# EAGLE board M840K (EAGLE 6.6.0), part 1 of 2
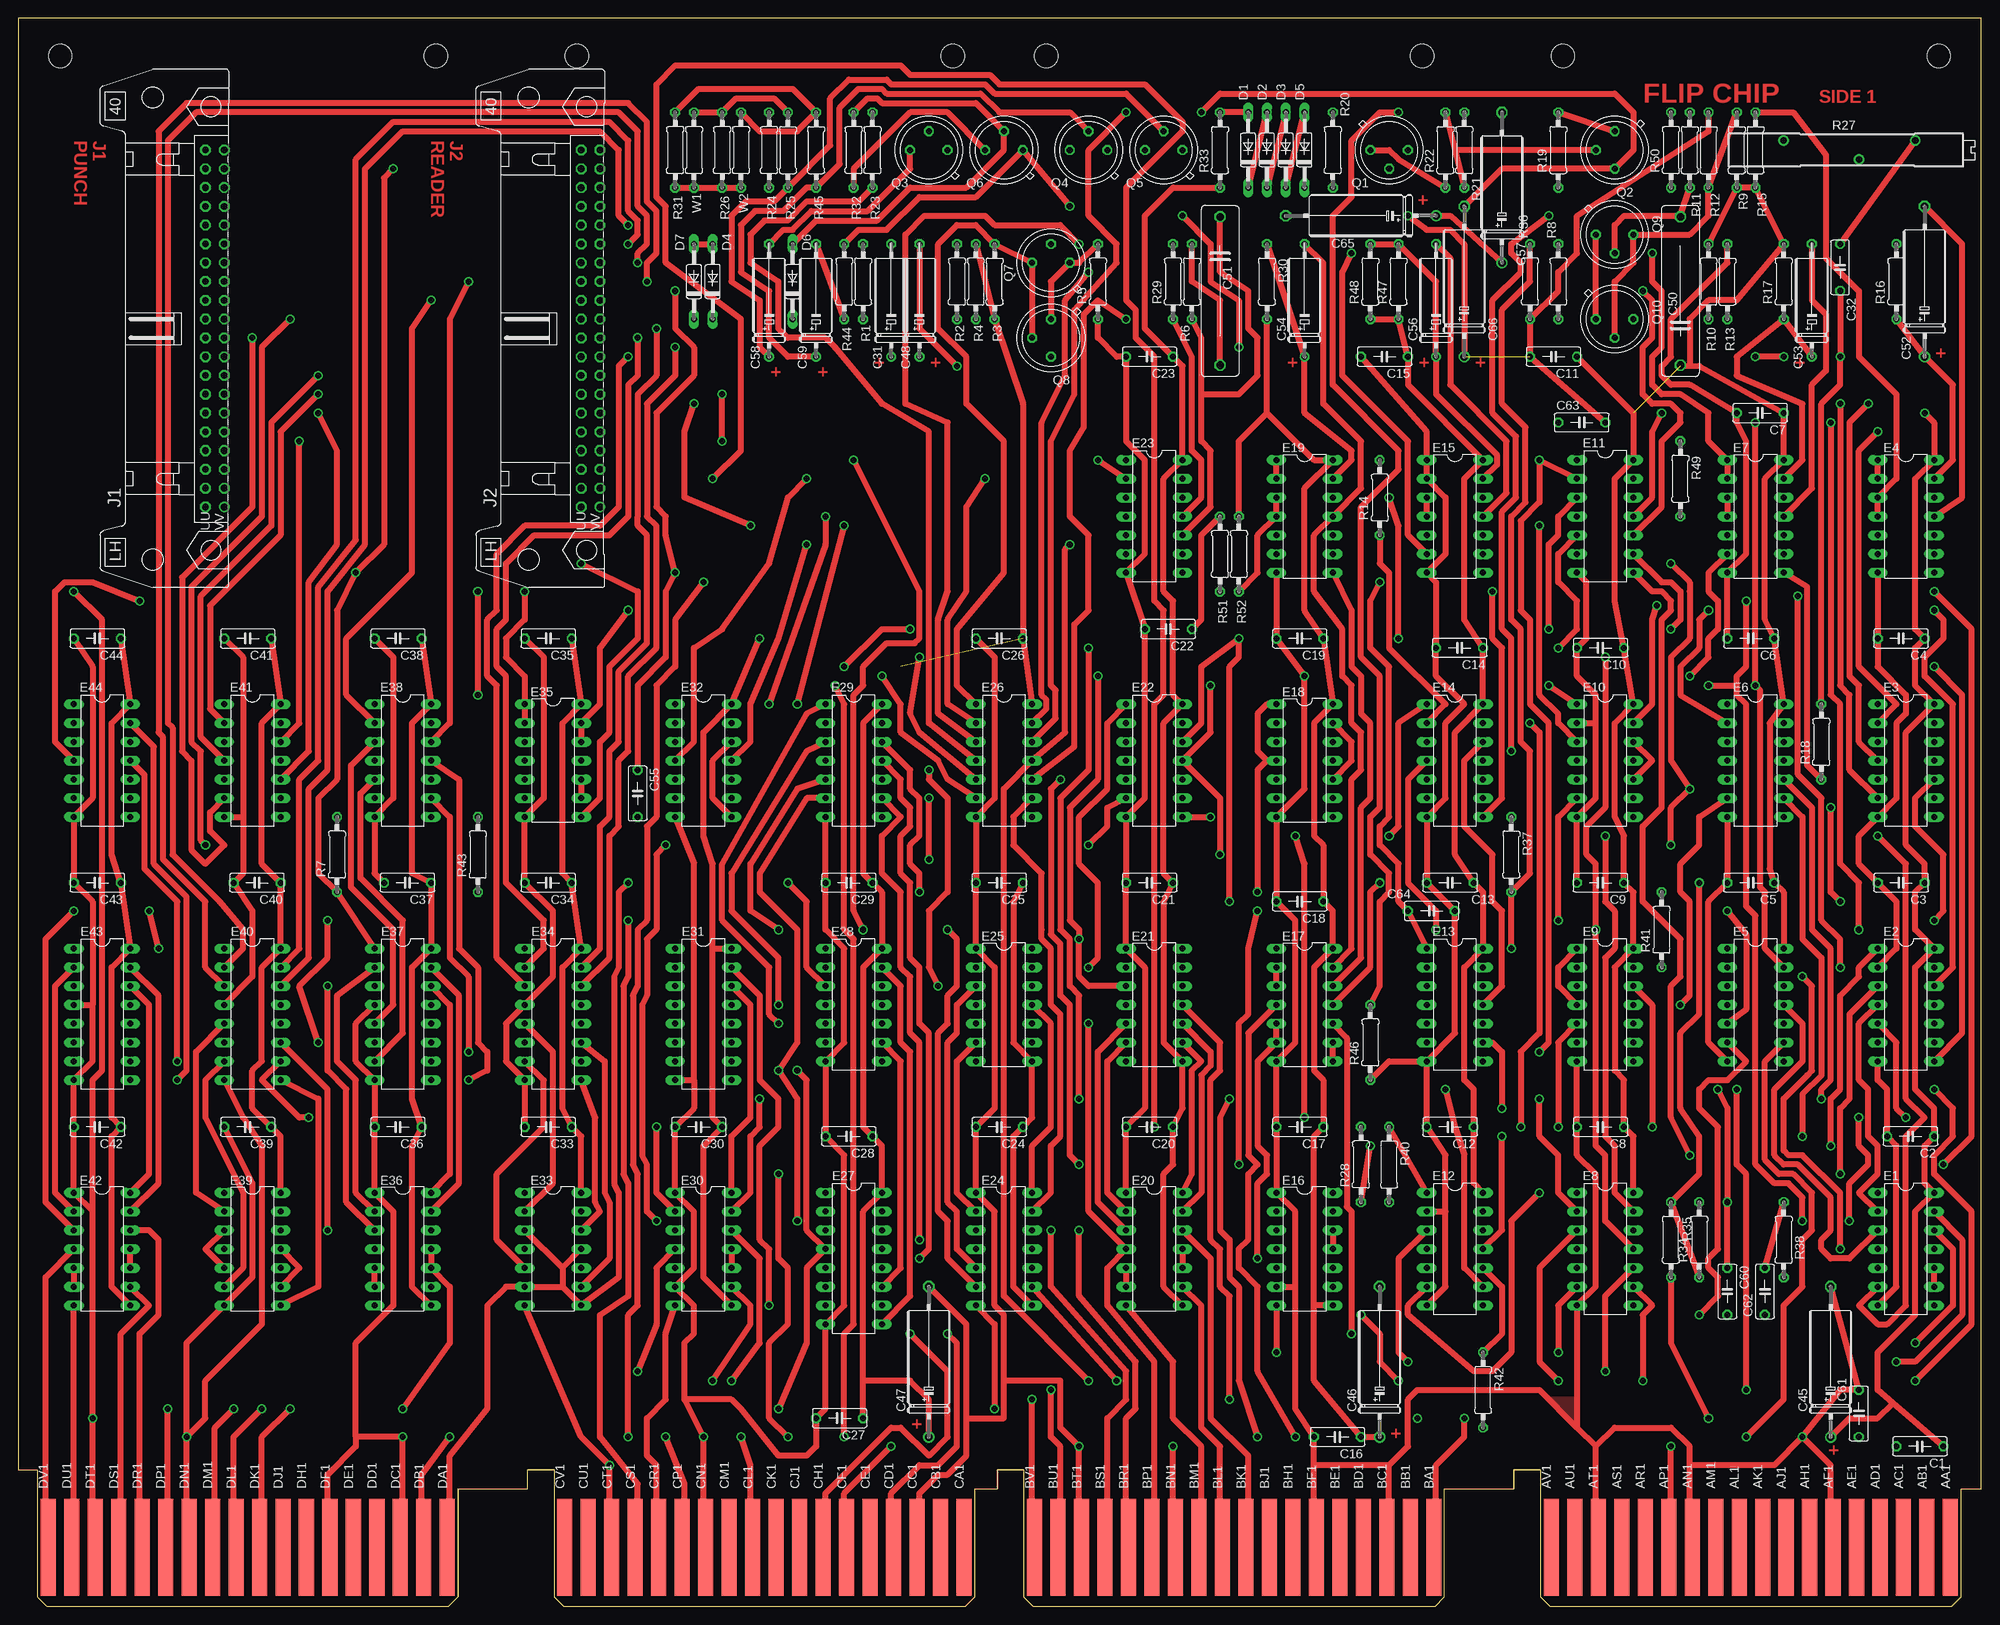
[diagram p4: board, top side]
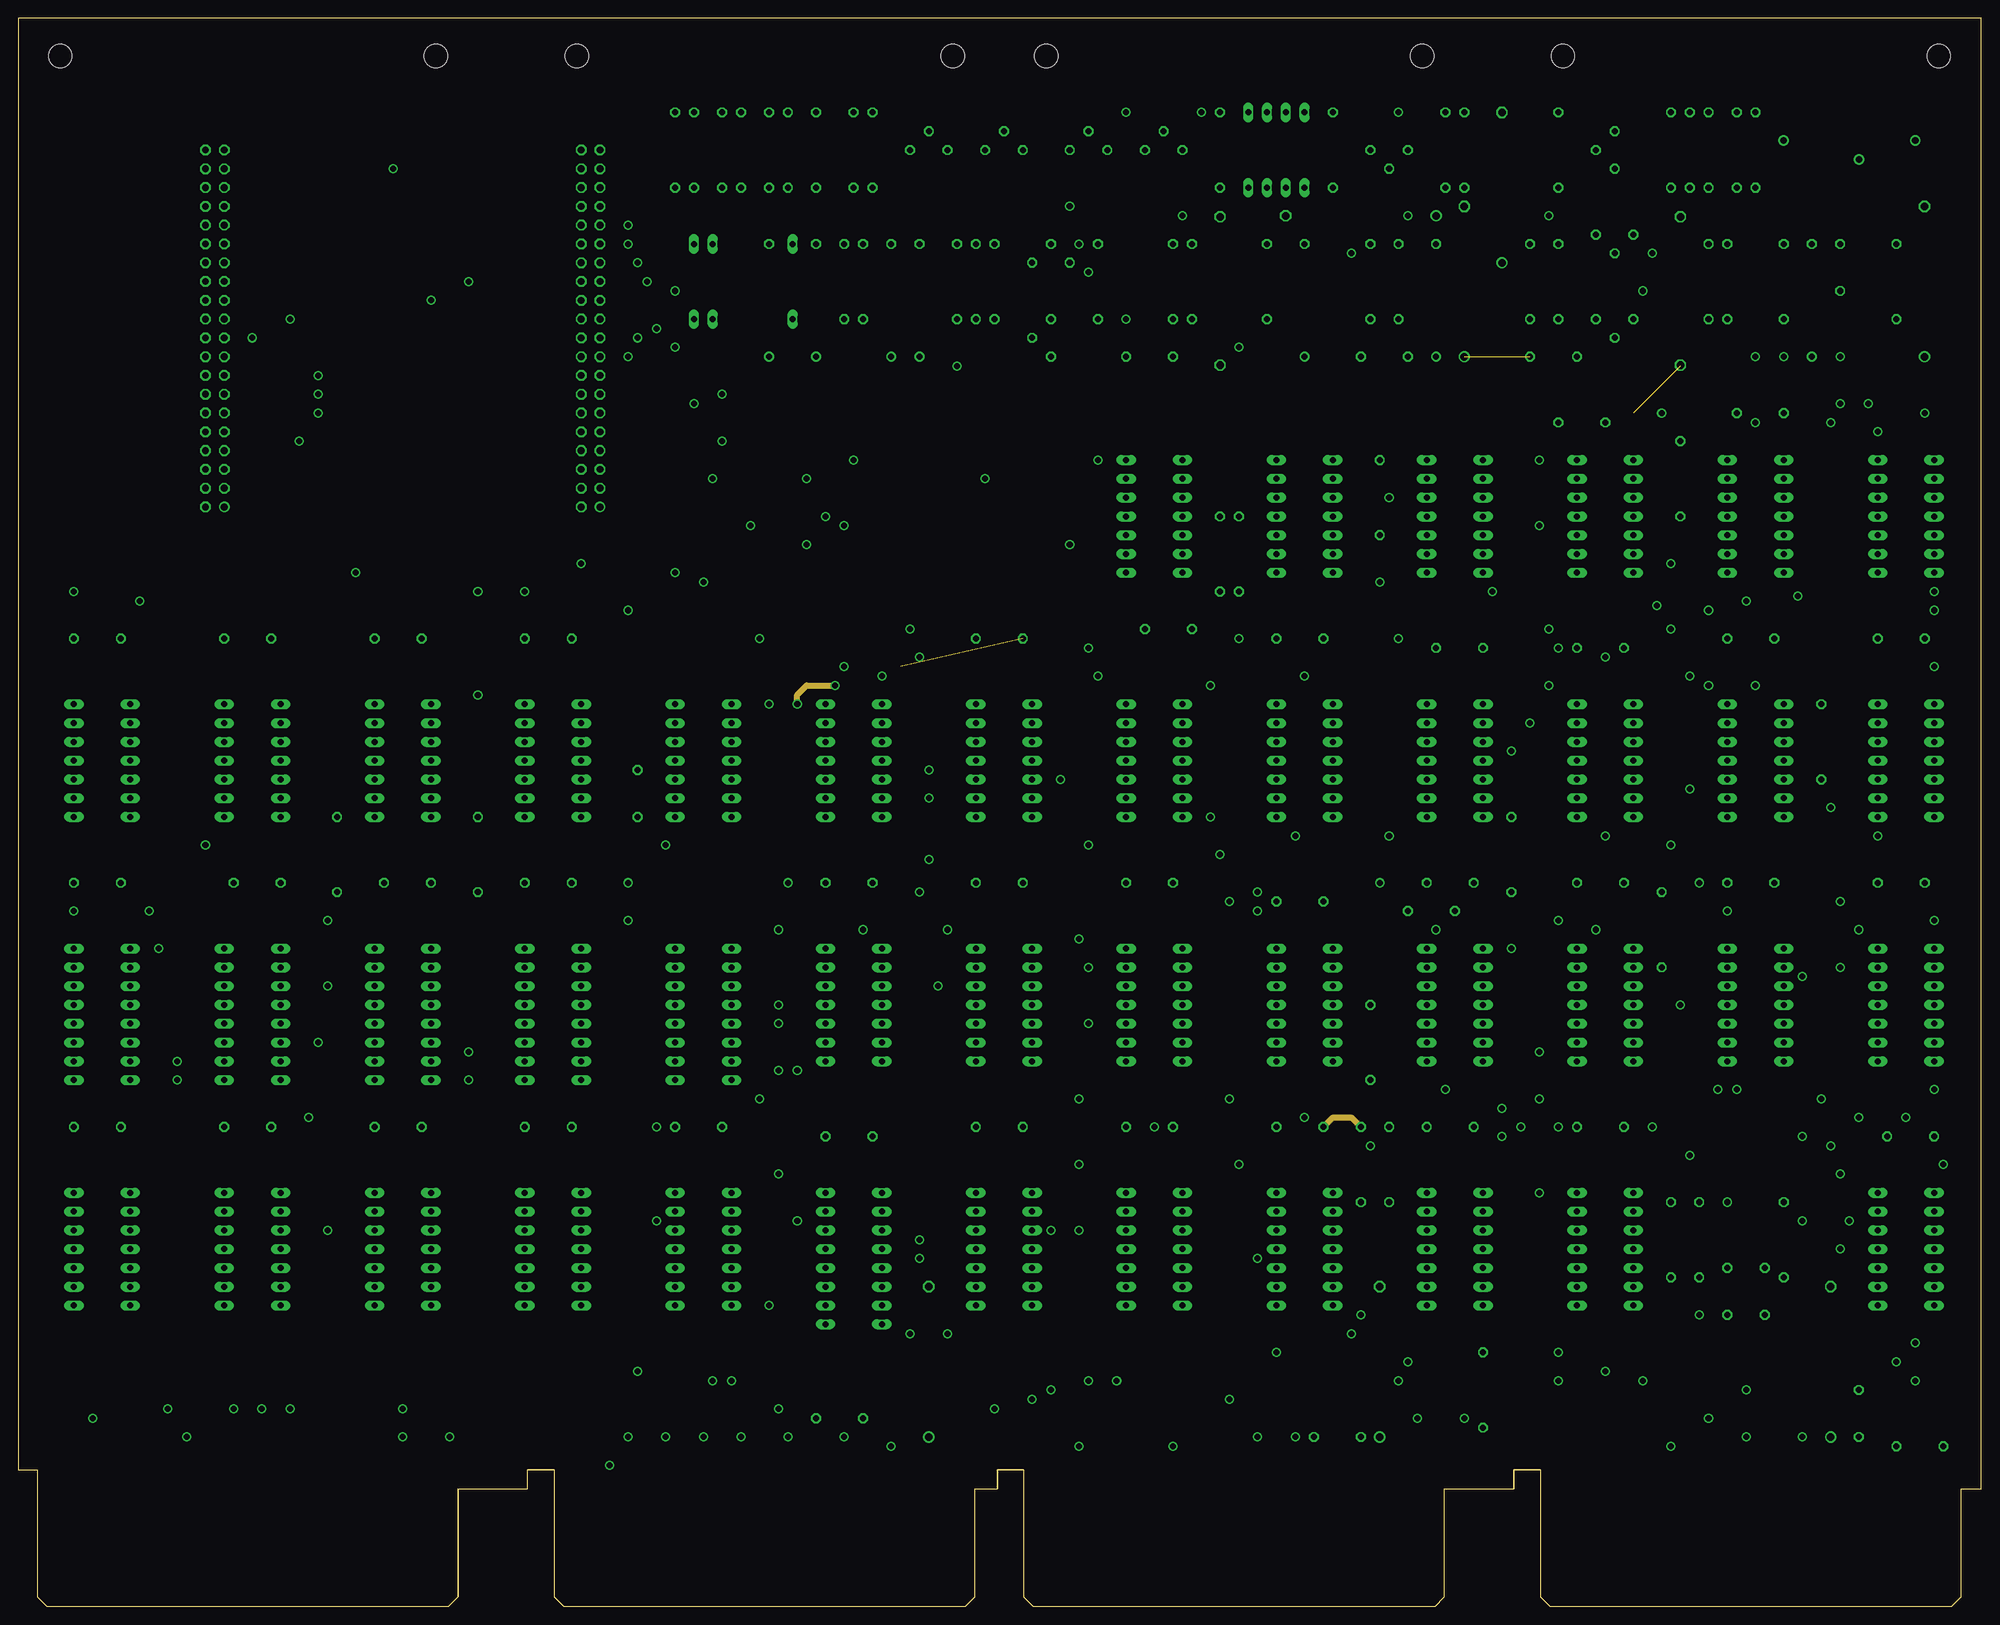
[diagram p5: board, inner layer ECO1]
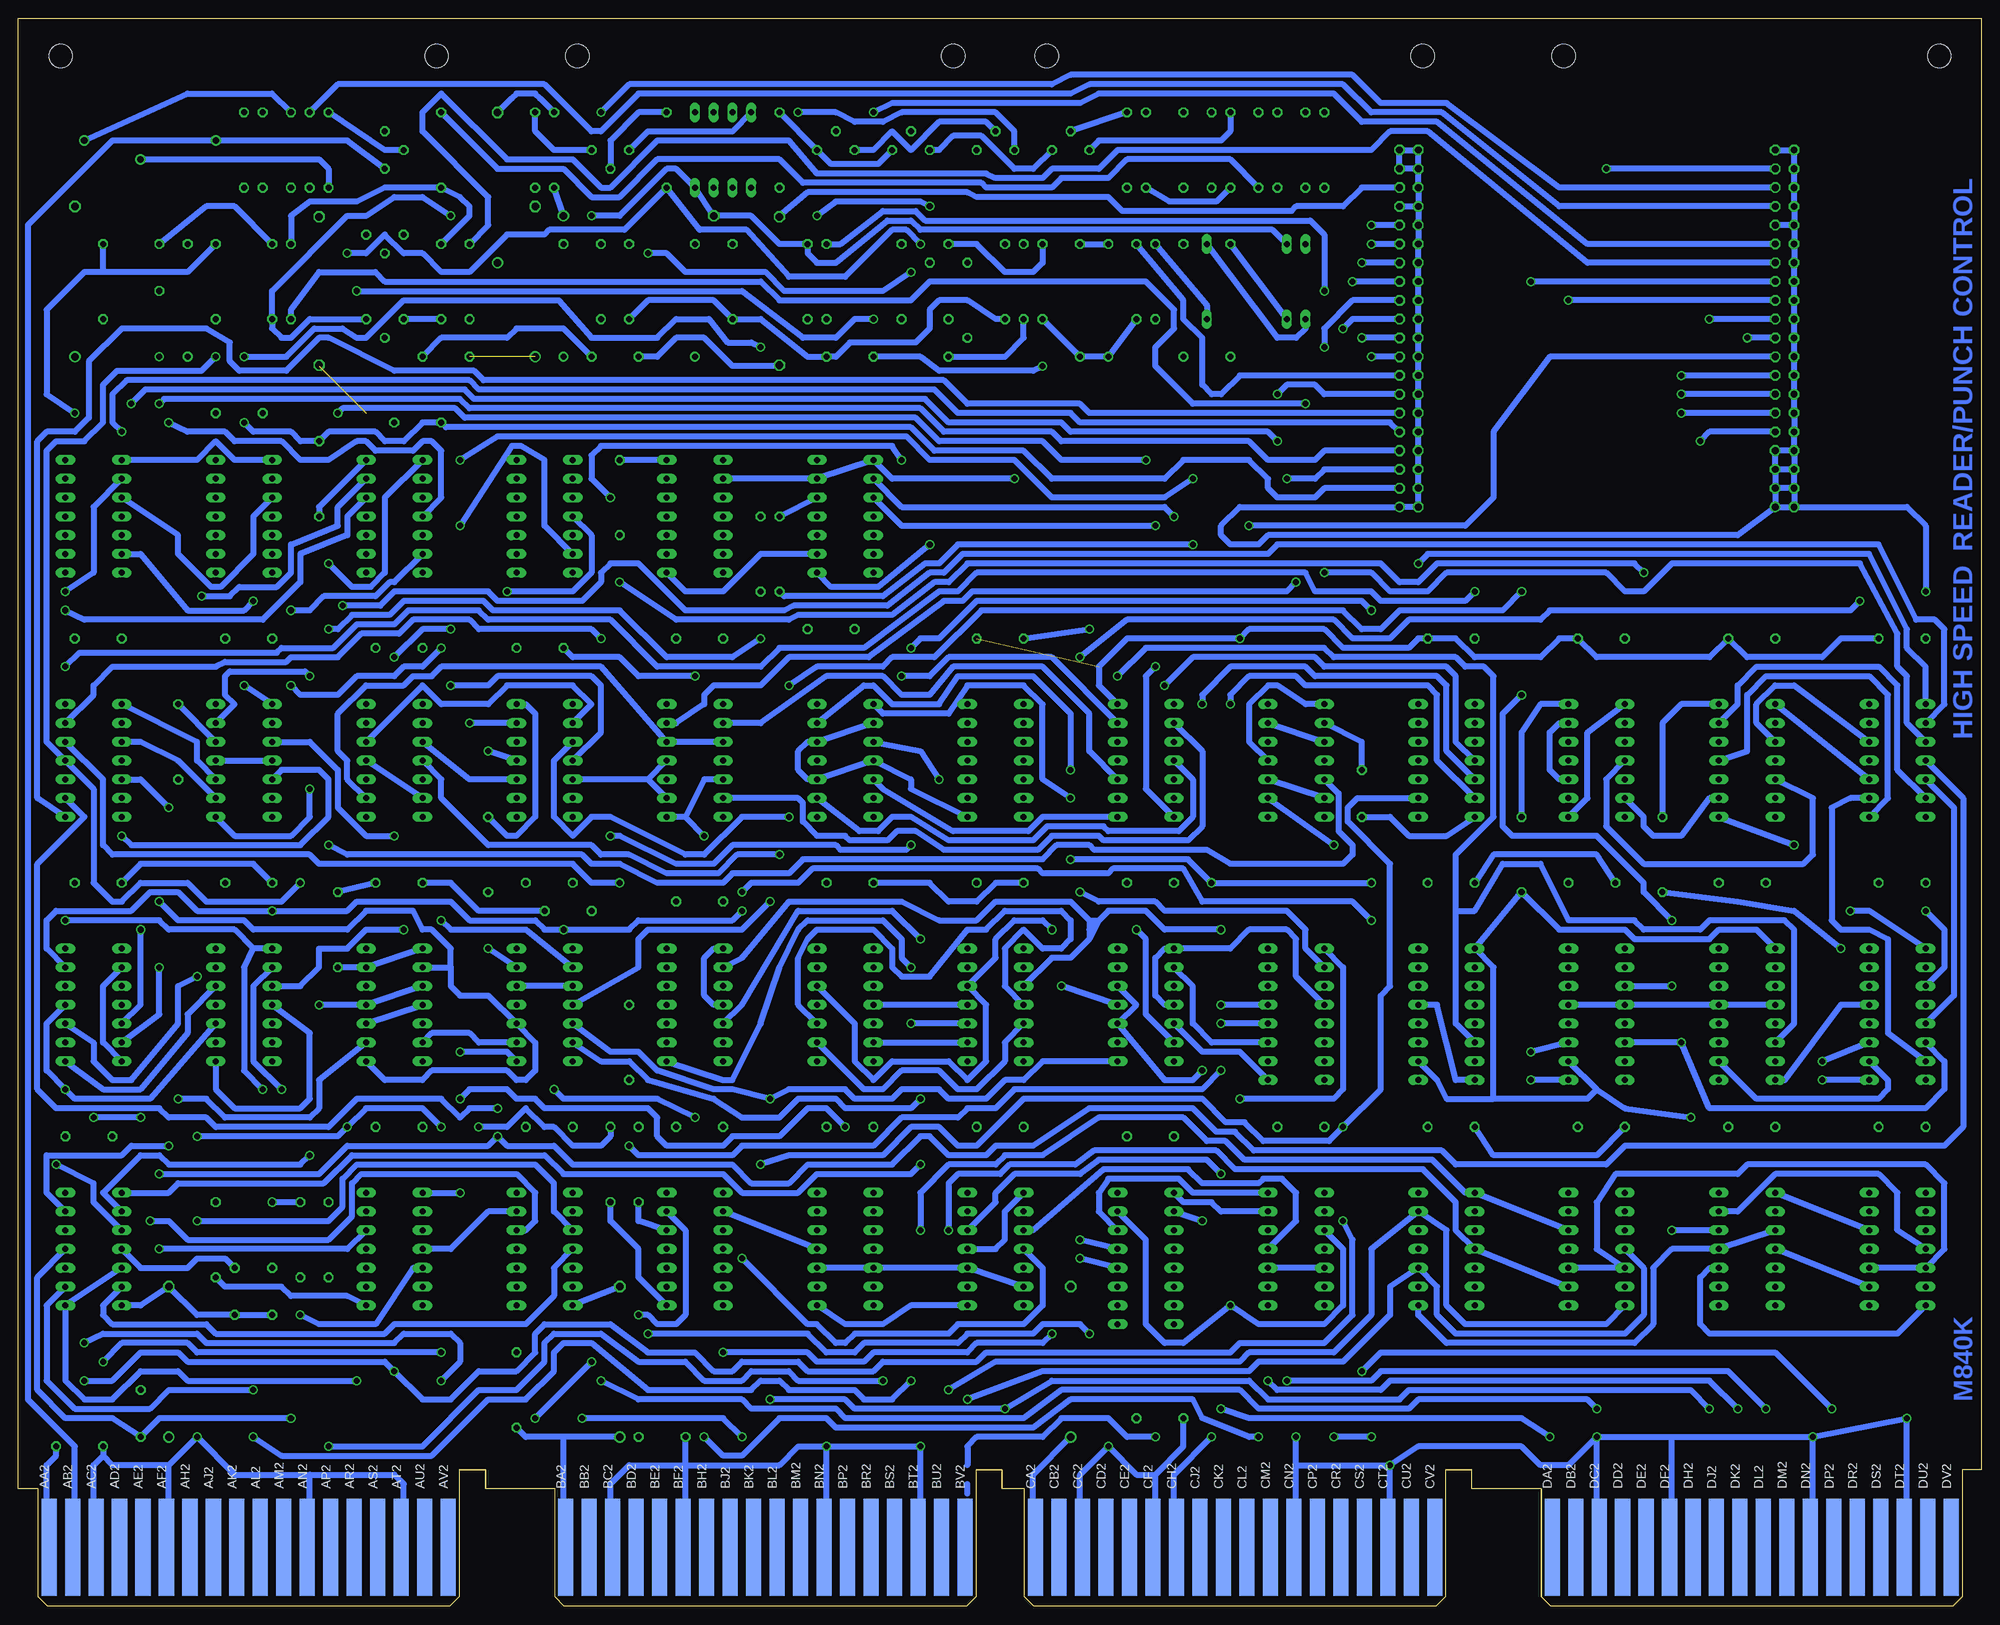
[diagram p6: board, bottom side, seen from below]

Size 265.3 x 214.63 mm. Coordinates in mm from the lower left corner, seen from the top.
Copper layers (1+2+15+16): Top 0.035mm / dielectric 1.5mm / ECO1 0.035mm / dielectric 0.15mm / ECO2 0.035mm / dielectric 0.2mm / Bottom 0.035mm
Design rules "16mils *": minimum track width 16mil, minimum drill 32mil, track to track 15mil, track to pad 10mil, pad to pad 10mil, via to via 10mil, smd to smd 10mil, copper to edge 13mil, drill to drill 10mil, minimum pad ring 10mil, minimum via ring 8mil, stop-mask expansion 0mil, vias tented up to drill 0mil, thermal gap 10mil
Net classes: 1 supply: width 0.813 mm

## Footprints (pad centres in the part's own frame; a part is rotated, then mirrored left to right if it is on the bottom)
C063-025X075 = drill 0.813 octagon: 1 -2.54,0; 2 3.81,0
E15-5 = drill 0.813: + -7.62,0 | drill 0.813 octagon: - 7.62,0
E12-8 = drill 1.016: + -10.16,0 | drill 1.016 octagon: - 10.16,0
C203-054-229 = drill 1.016 octagon: 1 -10.033,0; 2 10.033,0
DO35-10 = drill 0.813 long: A 5.08,0; C -5.08,0
DIL14 = drill 0.813 long: 1 -7.62,-3.81; 2 -5.08,-3.81; 3 -2.54,-3.81; 4 0,-3.81; 5 2.54,-3.81; 6 5.08,-3.81; 7 7.62,-3.81; 8 7.62,3.81; 9 5.08,3.81; 10 2.54,3.81; 11 0,3.81; 12 -2.54,3.81; 13 -5.08,3.81; 14 -7.62,3.81
DIL16 = drill 0.813 long: 1 -8.89,-3.81; 2 -6.35,-3.81; 3 -3.81,-3.81; 4 -1.27,-3.81; 5 1.27,-3.81; 6 3.81,-3.81; 7 6.35,-3.81; 8 8.89,-3.81; 9 8.89,3.81; 10 6.35,3.81; 11 3.81,3.81; 12 1.27,3.81; 13 -1.27,3.81; 14 -3.81,3.81; 15 -6.35,3.81; 16 -8.89,3.81
DEC40PINH = drill 0.914 octagon: A 24.13,1.27; AA -3.81,1.27; B 24.13,-1.27; BB -3.81,-1.27; C 21.59,1.27; CC -6.35,1.27; D 21.59,-1.27; DD -6.35,-1.27; E 19.05,1.27; EE -8.89,1.27; F 19.05,-1.27; FF -8.89,-1.27; H 16.51,1.27; HH -11.43,1.27; J 16.51,-1.27; JJ -11.43,-1.27; K 13.97,1.27; KK -13.97,1.27; L 13.97,-1.27; LL -13.97,-1.27; M 11.43,1.27; MM -16.51,1.27; N 11.43,-1.27; NN -16.51,-1.27; P 8.89,1.27; PP -19.05,1.27; R 8.89,-1.27; RR -19.05,-1.27; S 6.35,1.27; SS -21.59,1.27; T 6.35,-1.27; TT -21.59,-1.27; U 3.81,1.27; UU -24.13,1.27; V 3.81,-1.27; W 1.27,1.27; X 1.27,-1.27; Y -1.27,1.27; Z -1.27,-1.27 | drill 0.914: VV -24.13,-1.27
EDGE-CON8 = smd 2.032 x 13.106: AA1 261.303,7.938; AB1 258.127,7.938; AC1 254.952,7.938; AD1 251.778,7.938; AE1 248.602,7.938; AF1 245.428,7.938; AH1 242.252,7.938; AJ1 239.077,7.938; AK1 235.903,7.938; AL1 232.727,7.938; AM1 229.553,7.938; AN1 226.377,7.938; AP1 223.202,7.938; AR1 220.028,7.938; AS1 216.852,7.938; AT1 213.678,7.938; AU1 210.502,7.938; AV1 207.327,7.938; BA1 191.452,7.938; BB1 188.278,7.938; BC1 185.102,7.938; BD1 181.928,7.938; BE1 178.752,7.938; BF1 175.577,7.938; BH1 172.403,7.938; BJ1 169.227,7.938; BK1 166.053,7.938; BL1 162.877,7.938; BM1 159.702,7.938; BN1 156.528,7.938; BP1 153.352,7.938; BR1 150.178,7.938; BS1 147.002,7.938; BT1 143.827,7.938; BU1 140.653,7.938; BV1 137.477,7.938; CA1 127.953,7.938; CB1 124.778,7.938; CC1 121.603,7.938; CD1 118.427,7.938; CE1 115.252,7.938; CF1 112.078,7.938; CH1 108.903,7.938; CJ1 105.728,7.938; CK1 102.552,7.938; CL1 99.377,7.938; CM1 96.203,7.938; CN1 93.028,7.938; CP1 89.853,7.938; CR1 86.677,7.938; CS1 83.502,7.938; CT1 80.328,7.938; CU1 77.153,7.938; CV1 73.978,7.938; DA1 58.102,7.938; DB1 54.928,7.938; DC1 51.752,7.938; DD1 48.578,7.938; DE1 45.403,7.938; DF1 42.227,7.938; DH1 39.053,7.938; DJ1 35.877,7.938; DK1 32.703,7.938; DL1 29.527,7.938; DM1 26.352,7.938; DN1 23.177,7.938; DP1 20.003,7.938; DR1 16.828,7.938; DS1 13.652,7.938; DT1 10.477,7.938; DU1 7.303,7.938; DV1 4.128,7.938 | smd 2.032 x 13.106 bottom: AA2 261.303,7.938; AB2 258.127,7.938; AC2 254.952,7.938; AD2 251.778,7.938; AE2 248.602,7.938; AF2 245.428,7.938; AH2 242.252,7.938; AJ2 239.077,7.938; AK2 235.903,7.938; AL2 232.727,7.938; AM2 229.553,7.938; AN2 226.377,7.938; AP2 223.202,7.938; AR2 220.028,7.938; AS2 216.852,7.938; AT2 213.678,7.938; AU2 210.502,7.938; AV2 207.327,7.938; BA2 191.452,7.938; BB2 188.278,7.938; BC2 185.102,7.938; BD2 181.928,7.938; BE2 178.752,7.938; BF2 175.577,7.938; BH2 172.403,7.938; BJ2 169.227,7.938; BK2 166.053,7.938; BL2 162.877,7.938; BM2 159.702,7.938; BN2 156.528,7.938; BP2 153.352,7.938; BR2 150.178,7.938; BS2 147.002,7.938; BT2 143.827,7.938; BU2 140.653,7.938; BV2 137.477,7.938; CA2 127.953,7.938; CB2 124.778,7.938; CC2 121.603,7.938; CD2 118.427,7.938; CE2 115.252,7.938; CF2 112.078,7.938; CH2 108.903,7.938; CJ2 105.728,7.938; CK2 102.552,7.938; CL2 99.377,7.938; CM2 96.203,7.938; CN2 93.028,7.938; CP2 89.853,7.938; CR2 86.677,7.938; CS2 83.502,7.938; CT2 80.328,7.938; CU2 77.153,7.938; CV2 73.978,7.938; DA2 58.102,7.938; DB2 54.928,7.938; DC2 51.752,7.938; DD2 48.578,7.938; DE2 45.403,7.938; DF2 42.227,7.938; DH2 39.053,7.938; DJ2 35.877,7.938; DK2 32.703,7.938; DL2 29.527,7.938; DM2 26.352,7.938; DN2 23.177,7.938; DP2 20.003,7.938; DR2 16.828,7.938; DS2 13.652,7.938; DT2 10.477,7.938; DU2 7.303,7.938; DV2 4.128,7.938
TO5 = drill 0.813 octagon: 1 0,-2.54; 2 2.54,0; 3 0,2.54
0207/10 = drill 0.813 octagon: 1 -5.08,0; 2 5.08,0
3006Y = drill 0.9: 1 -8.89,1.27; 2 1.27,-1.27; 3 8.89,1.27
OMNIBUS = hole 3.175: 208.915,209.55; 259.715,209.55; 189.865,209.55; 139.065,209.55; 75.616,209.55; 126.416,209.55; 56.566,209.55; 5.766,209.55

## Placement (x,y rotation side)
C1  .01uF  [C063-025X075]  257.68,21.59 180 top
C2  .01uF  [C063-025X075]  256.41,63.5 180 top
C3  .01uF  [C063-025X075]  255.14,97.79 180 top
C4  .01uF  [C063-025X075]  255.14,130.81 180 top
C5  .01uF  [C063-025X075]  234.82,97.79 180 top
C6  .01uF  [C063-025X075]  234.82,130.81 180 top
C7  .01uF  [C063-025X075]  236.09,161.29 180 top
C8  .01uF  [C063-025X075]  214.5,64.77 180 top
C9  .01uF  [C063-025X075]  214.5,97.79 180 top
C10  .01uF  [C063-025X075]  214.5,129.54 180 top
C11  .01uF  [C063-025X075]  208.15,168.91 180 top
C12  .01uF  [C063-025X075]  194.18,64.77 180 top
C13  .01uF  [C063-025X075]  194.18,97.79 180 top
C14  .01uF  [C063-025X075]  195.45,129.54 180 top
C15  .01uF  [C063-025X075]  185.29,168.91 180 top
C16  .01uF  [C063-025X075]  178.94,22.86 180 top
C17  .01uF  [C063-025X075]  173.86,64.77 180 top
C18  .01uF  [C063-025X075]  173.86,95.25 180 top
C19  .01uF  [C063-025X075]  173.86,130.81 180 top
C20  .01uF  [C063-025X075]  153.54,64.77 180 top
C21  .01uF  [C063-025X075]  153.54,97.79 180 top
C22  680pF  [C063-025X075]  156.08,132.08 180 top
C23  .01uF  [C063-025X075]  153.54,168.91 180 top
C24  .01uF  [C063-025X075]  133.22,64.77 180 top
C25  .01uF  [C063-025X075]  133.22,97.79 180 top
C26  .01uF  [C063-025X075]  133.22,130.81 180 top
C27  .01uF  [C063-025X075]  111.63,25.4 180 top
C28  .01uF  [C063-025X075]  112.9,63.5 180 top
C29  .01uF  [C063-025X075]  112.9,97.79 180 top
C30  .01uF  [C063-025X075]  92.58,64.77 180 top
C31  OPEN  [E15-5]  117.98,176.53 90 top
C32  680pF  [C063-025X075]  246.25,180.34 90 top
C33  .01uF  [C063-025X075]  72.26,64.77 180 top
C34  .01uF  [C063-025X075]  72.26,97.79 180 top
C35  .01uF  [C063-025X075]  72.26,130.81 180 top
C36  .01uF  [C063-025X075]  51.94,64.77 180 top
C37  .01uF  [C063-025X075]  53.21,97.79 180 top
C38  .01uF  [C063-025X075]  51.94,130.81 180 top
C39  .01uF  [C063-025X075]  31.62,64.77 180 top
C40  .01uF  [C063-025X075]  32.89,97.79 180 top
C41  .01uF  [C063-025X075]  31.62,130.81 180 top
C42  .01uF  [C063-025X075]  11.3,64.77 180 top
C43  .01uF  [C063-025X075]  11.3,97.79 180 top
C44  .01uF  [C063-025X075]  11.3,130.81 180 top
C45  6.8uF  [E12-8]  244.98,33.02 90 top
C46  6.8uF  [E12-8]  184.02,33.02 90 top
C47  6.8uF  [E12-8]  123.06,33.02 90 top
C48  2.2uF  [E15-5]  121.79,176.53 90 top
C50  .01uF  [C203-054-229]  224.66,177.8 90 top
C51  .01uF  [C203-054-229]  162.43,177.8 270 top
C52  15uF  [E12-8]  257.68,179.07 90 top
C53  1uF  [E15-5]  242.44,176.53 90 top
C54  3.9uF  [E15-5]  173.86,176.53 90 top
C55  2500pF  [C063-025X075]  83.69,110.49 270 top
C56  2.2uF  [E15-5]  191.64,176.53 90 top
C57  6.8uF  [E12-8]  200.53,191.77 90 top
C58  1uF  [E15-5]  101.47,176.53 90 top
C59  1uF  [E15-5]  107.82,176.53 90 top
C60  1000pF  [C063-025X075]  231.01,43.18 270 top
C61  1500pF  [C063-025X075]  248.79,25.4 90 top
C62  680pF  [C063-025X075]  236.09,43.18 270 top
C63  330pF  [C063-025X075]  210.69,160.02 0 top
C64  330pF  [C063-025X075]  190.37,93.98 0 top
C65  39uF  [E12-8]  181.48,187.96 180 top
C66  6.8uF  [E12-8]  195.45,179.07 90 top
D1  D662  [DO35-10]  166.24,196.85 90 top
D2  D662  [DO35-10]  168.78,196.85 90 top
D3  D662  [DO35-10]  171.32,196.85 90 top
D4  D664  [DO35-10]  93.85,179.07 90 top
D5  D662  [DO35-10]  173.86,196.85 90 top
D6  D664  [DO35-10]  104.65,179.07 90 top
D7  D664  [DO35-10]  91.31,179.07 90 top
E1  7410N  [DIL14]  255.14,48.26 270 top
E2  7474N  [DIL14]  255.14,81.28 270 top
E3  7404N  [DIL14]  255.14,114.3 270 top
E4  9601  [DIL14]  255.14,147.32 270 top
E5  7400N  [DIL14]  234.82,81.28 270 top
E6  7400N  [DIL14]  234.82,114.3 270 top
E7  9601  [DIL14]  234.82,147.32 270 top
E8  7404N  [DIL14]  214.5,48.26 270 top
E9  7474N  [DIL14]  214.5,81.28 270 top
E10  7474N  [DIL14]  214.5,114.3 270 top
E11  7410N  [DIL14]  214.5,147.32 270 top
E12  7474N  [DIL14]  194.18,48.26 270 top
E13  7400N  [DIL14]  194.18,81.28 270 top
E14  7474N  [DIL14]  194.18,114.3 270 top
E15  9601  [DIL14]  194.18,147.32 270 top
E16  SP384N  [DIL14]  173.86,48.26 270 top
E17  N8881N  [DIL14]  173.86,81.28 270 top
E18  N8881N  [DIL14]  173.86,114.3 270 top
E19  9601  [DIL14]  173.86,147.32 270 top
E20  SP380N  [DIL14]  153.54,48.26 270 top
E21  SP314N  [DIL14]  153.54,81.28 270 top
E22  7400N  [DIL14]  153.54,114.3 270 top
E23  7400N  [DIL14]  153.54,147.32 270 top
E24  SP380N  [DIL14]  133.22,48.26 270 top
E25  SP314N  [DIL14]  133.22,81.28 270 top
E26  7404N  [DIL14]  133.22,114.3 270 top
E27  DEC8251  [DIL16]  112.9,46.99 270 top
E28  7400N  [DIL14]  112.9,81.28 270 top
E29  7404N  [DIL14]  112.9,114.3 270 top
E30  SP380N  [DIL14]  92.58,48.26 270 top
E31  DEC8251  [DIL16]  92.58,80.01 270 top
E32  7400N  [DIL14]  92.58,114.3 270 top
E33  N8881N  [DIL14]  72.26,48.26 270 top
E34  DEC8271  [DIL16]  72.26,80.01 270 top
E35  7420N  [DIL14]  72.26,114.3 270 top
E36  SP380N  [DIL14]  51.94,48.26 270 top
E37  DEC8271  [DIL16]  51.94,80.01 270 top
E38  7404N  [DIL14]  51.94,114.3 270 top
E39  N8881N  [DIL14]  31.62,48.26 270 top
E40  DEC8271  [DIL16]  31.62,80.01 270 top
E41  7404N  [DIL14]  31.62,114.3 270 top
E42  SP380N  [DIL14]  11.3,48.26 270 top
E43  DEC8271  [DIL16]  11.3,80.01 270 top
E44  7404N  [DIL14]  11.3,114.3 270 top
J1  DEC40PINSH  [DEC40PINH]  26.54,172.72 90 top
J2  DEC40PINSH  [DEC40PINH]  77.34,172.72 90 top
OMNIBUS  QUAD  [EDGE-CON8]  -0.13,0 0 top
Q1  MPS6534  [TO5]  185.29,196.85 270 top
Q2  MPS6534  [TO5]  215.77,196.85 180 top
Q3  MPS6534  [TO5]  123.06,196.85 90 top
Q4  MPS6534  [TO5]  144.65,196.85 90 top
Q5  MPS6534  [TO5]  154.81,196.85 90 top
Q6  MPS6534  [TO5]  133.22,196.85 90 top
Q7  MPS6531  [TO5]  139.57,181.61 90 top
Q8  MPS6531  [TO5]  139.57,171.45 180 top
Q9  MPS6534  [TO5]  215.77,185.42 270 top
Q10  MPS6534  [TO5]  215.77,173.99 270 top
R1  220  [0207/10]  114.17,179.07 270 top
R2  4.7K  [0207/10]  126.87,179.07 90 top
R3  4.7K  [0207/10]  131.95,179.07 270 top
R4  220  [0207/10]  129.41,179.07 90 top
R5  100  [0207/10]  145.92,179.07 90 top
R6  220  [0207/10]  158.62,179.07 270 top
R7  3K  [0207/10]  43.05,101.6 90 top
R8  56  [0207/10]  208.15,179.07 90 top
R9  5.6K  [0207/10]  232.28,196.85 270 top
R10  100  [0207/10]  228.47,179.07 90 top
R11  3K  [0207/10]  225.93,196.85 270 top
R12  3K  [0207/10]  228.47,196.85 270 top
R13  150  [0207/10]  231.01,179.07 270 top
R14  3K  [0207/10]  184.02,149.86 90 top
R15  3K  [0207/10]  234.82,196.85 270 top
R16  15K  [0207/10]  253.87,179.07 90 top
R17  1.5K  [0207/10]  238.63,179.07 90 top
R18  220  [0207/10]  243.71,116.84 90 top
R19  3K  [0207/10]  208.15,196.85 270 top
R20  3K  [0207/10]  177.67,196.85 90 top
R21  680  [0207/10]  195.45,196.85 90 top
R22  3K  [0207/10]  192.91,196.85 270 top
R23  3K  [0207/10]  115.44,196.85 90 top
R24  3K  [0207/10]  101.47,196.85 90 top
R25  3K  [0207/10]  104.01,196.85 270 top
R26  3K  [0207/10]  95.12,196.85 90 top
R27  1K  [3006Y]  247.52,196.85 0 top
R28  3K  [0207/10]  181.48,59.69 90 top
R29  100  [0207/10]  156.08,179.07 90 top
R30  10K  [0207/10]  168.78,179.07 270 top
R31  3K  [0207/10]  88.77,196.85 90 top
R32  3K  [0207/10]  112.9,196.85 90 top
R33  47  [0207/10]  162.43,196.85 270 top
R34  220  [0207/10]  227.2,49.53 90 top
R35  330  [0207/10]  223.39,49.53 270 top
R36  10K  [0207/10]  204.34,179.07 90 top
R37  3K  [0207/10]  201.8,101.6 270 top
R38  220  [0207/10]  238.63,49.53 90 top
R40  3K  [0207/10]  185.29,59.69 270 top
R41  3K  [0207/10]  222.12,91.44 90 top
R42  3K  [0207/10]  197.99,29.21 270 top
R43  3K  [0207/10]  62.1,101.6 90 top
R44  75  [0207/10]  111.63,179.07 90 top
R45  3K  [0207/10]  107.82,196.85 270 top
R46  10K  [0207/10]  182.75,76.2 90 top
R47  18K  [0207/10]  186.56,179.07 270 top
R48  OPEN  [0207/10]  182.75,179.07 270 top
R49  270  [0207/10]  224.66,152.4 270 top
R50  1.5K  [0207/10]  223.39,196.85 90 top
R51  220  [0207/10]  162.43,142.24 90 top
R52  3K  [0207/10]  164.97,142.24 90 top
U$1  OUTLINE-OMNIBUS  [OMNIBUS]  -0.13,0 0 top
W1  0  [0207/10]  91.31,196.85 90 top
W2  0  [0207/10]  97.66,196.85 90 top

## Tracks (layer width: path | path; a pad name or v marks a point on that pad's centre or on a via)
!AB  (via drill 0.81)
  Top 0.813: v223.39,140.97 225.93,138.43 225.93,137.16 225.93,130.81 223.39,128.27 223.39,114.3 v225.93,110.49 223.39,107.95 v223.39,102.87
  Bottom 0.813: E32.5 86.87,109.86 86.87,104.78 84.96,102.87 84.96,101.6 86.23,100.33 101.47,100.33 104.65,102.23 119.89,102.23 120.52,102.87 124.97,102.87 126.87,100.97 159.26,100.97 161.16,99.06 168.78,99.06 170.05,97.79 178.94,97.79 184.02,100.33 187.83,100.33 189.1,101.6 220.85,101.6 v223.39,102.87 | E6.8 236.09,104.14 228.47,104.14 225.93,106.68 v225.93,110.49 | E11.1 215.77,149.86 215.77,139.7 217.68,137.79 220.22,137.79 v223.39,140.97
!BA  (via drill 0.81)
  Top 0.813: v95.12,157.48 v95.12,163.83 | v250.06,162.56 247.52,160.02 247.52,125.73 248.79,124.46 248.79,116.84 E3.4
  Bottom 0.813: J2.FF 88.77,163.83 90.04,165.1 93.85,165.1 v95.12,163.83 | v95.12,157.48 96.39,158.75 123.06,158.75 124.33,160.02 139.57,160.02 142.75,163.19 203.71,163.19 204.98,164.47 248.16,164.47 v250.06,162.56
!BB  (via drill 0.81)
  Top 0.813: v251.33,158.75 248.79,156.21 248.79,127 253.87,121.92 E3.2
  Bottom 0.813: J2.LL 79.88,160.02 121.79,160.02 123.06,161.29 138.3,161.29 141.48,164.47 203.07,164.47 204.34,165.74 250.7,165.74 252.6,163.83 252.6,160.02 v251.33,158.75
!C1  (via drill 0.81)
  Top 0.813: OMNIBUS.CH1 109.09,10.16 109.09,15.24 117.98,24.13 119.25,24.13 123.06,20.32 125.6,22.86 125.6,31.75 v120.52,36.83 | E17.10 179.58,76.83 179.58,53.98 180.21,53.34 v180.21,36.83
  Bottom 0.813: v120.52,36.83 121.79,38.1 126.87,38.1 128.14,36.83 137.03,36.83 138.3,35.56 151,35.56 152.27,34.29 156.08,34.29 158.62,36.83 v180.21,36.83
!CATCH_PULSE
  Bottom 0.813: E6.11 E6.4
!CLOCK_PULSE  (via drill 0.81)
  Top 0.813: v214.5,128.27 214.5,107.95 211.96,105.41 211.96,101.6 213.23,100.33 v213.23,91.44 213.23,62.23 214.5,60.96 214.5,52.07 E8.11 | v206.88,132.08 206.88,143.51 208.15,144.78 208.15,147.32 E11.3
  Bottom 0.813: E5.3 227.2,83.82 224.66,86.36 224.66,88.9 220.85,88.9 218.31,91.44 v213.23,91.44 | v206.88,132.08 210.69,132.08 v214.5,128.27
!DATA04  (via drill 0.81)
  Top 0.813: OMNIBUS.BR1 149.73,10.16 149.73,25.4 151,26.67 151,33.02 143.38,41.91 v143.38,50.8
  Bottom 0.813: E36.12 E33.1 69.72,55.88 74.17,60.33 99.57,60.33 102.11,62.87 104.65,62.87 107.82,66.04 119.25,66.04 126.87,60.96 131.95,60.96 133.22,59.69 139.57,59.69 143.38,55.88 v143.38,50.8
!DATA05  (via drill 0.81)
  Top 0.813: OMNIBUS.BS1 147.19,10.16 147.19,25.4 149.73,27.94 149.73,31.75 139.57,43.18 v139.57,50.8
  Bottom 0.813: E36.9 E33.4 70.99,50.8 70.99,54.61 75.44,59.05 100.84,59.05 103.38,61.59 119.89,61.59 122.43,59.69 131.32,59.69 132.59,58.42 138.3,58.42 139.57,57.15 v139.57,50.8
!DATA06  (via drill 0.81)
  Top 0.813: OMNIBUS.BU1 140.84,8.89 140.84,21.59 139.57,22.86 v139.57,29.21
  Bottom 0.813: E36.7 50.67,38.1 69.72,38.1 72.26,40.64 72.26,50.8 E33.13 82.42,48.26 82.42,39.37 87.5,34.29 98.93,34.29 100.2,33.02 133.22,33.02 v139.57,29.21
!DATA07  (via drill 0.81)
  Top 0.813: OMNIBUS.BV1 137.03,8.89 v137.03,27.94
  Bottom 0.813: E36.4 45.59,45.72 45.59,39.37 48.13,36.83 70.99,36.83 73.53,39.37 73.53,43.18 E33.10 79.88,43.18 79.88,39.37 86.23,33.02 97.66,33.02 98.93,31.75 126.87,31.75 v137.03,27.94
!DATA08
  Top 0.813: OMNIBUS.DR1 16.38,8.89 16.38,36.83 18.92,39.37 18.92,49.53 17.65,50.8 E42.12
  Bottom 0.813: E42.12 E39.1
!DATA09
  Top 0.813: OMNIBUS.DS1 13.84,8.89 13.84,36.83 17.65,40.64 E42.9
  Bottom 0.813: E42.9 E39.4
!DATA10
  Top 0.813: OMNIBUS.DU1 7.49,8.89 E42.7
  Bottom 0.813: E42.7 11.3,36.83 36.7,36.83 37.97,38.1 37.97,44.45 36.7,45.72 E39.10
!DATA11
  Top 0.813: OMNIBUS.DV1 3.68,8.89 3.68,44.45 E42.4
  Bottom 0.813: E42.4 11.3,50.8 11.3,55.88 13.84,58.42 27.81,58.42 32.89,53.34 E39.13
!ENA_PUN_BUFFR  (via drill 0.81)
  Top 0.813: E42.5 E42.6 | E42.10 E42.11 | E36.6 E36.5 | E36.11 E36.10 58.29,43.18 58.29,35.56 v51.94,26.67 | v181.48,39.37 184.02,36.83 184.02,33.02 v186.56,30.48
  Bottom 0.813: E36.10 E36.5 51.94,48.26 51.94,54.61 49.4,58.42 32.89,58.42 31.62,59.69 7.49,59.69 4.95,57.15 4.95,48.26 E42.5 E42.10 | E16.13 175.13,50.8 175.13,39.37 176.4,38.1 178.94,38.1 180.21,39.37 v181.48,39.37 | v51.94,26.67 53.21,27.94 76.07,27.94 77.34,26.67 97.66,26.67 100.2,29.21 124.33,29.21 129.41,25.4 153.54,25.4 154.81,26.67 166.24,26.67 167.51,27.94 181.48,27.94 v186.56,30.48
!ENABLE
  Top 0.813: E26.4 123.06,119.38 123.06,158.75 116.71,162.56 110.36,170.18 109.09,171.45 104.01,171.45 102.74,172.72 102.74,179.07 98.93,181.61 98.93,185.42 100.84,187.32 104.01,187.32 106.55,189.87 113.54,189.87 R23.1
!INIT+EOT  (via drill 0.81)
  Top 0.813: E8.6 208.15,40.64 v208.15,34.29 | E1.13 262.76,49.53 262.76,39.37 256.41,33.02 v253.87,33.02 | v244.98,62.23 244.98,68.58 246.25,69.85 246.25,82.55 248.79,85.09 248.79,86.36 E2.1
  Bottom 0.813: E1.13 261.49,55.88 261.49,60.96 251.33,60.96 250.06,62.23 v244.98,62.23 | v208.15,34.29 241.17,34.29 242.44,35.56 251.33,35.56 v253.87,33.02
!INITIALIZE  (via drill 0.81)
  Top 0.813: E35.10 E35.9 | E30.2 86.23,55.88 v86.23,64.77 | E14.4 187.83,111.76 187.83,97.79 191.64,93.98 v191.64,91.44 | v164.97,59.69 164.97,78.74 166.24,80.01 166.24,88.9 v167.51,93.98 | v231.01,93.98 233.55,90.81 233.55,80.64 E5.5 | v206.88,124.46 E10.1
  Bottom 0.813: E35.9 84.33,109.22 85.6,107.95 85.6,106.05 79.88,100.33 79.88,83.82 81.15,82.55 81.15,69.85 v86.23,64.77 88.14,62.87 97.03,62.87 99.57,65.41 102.11,65.41 105.28,68.58 129.41,68.58 135.76,62.23 138.3,62.23 140.84,64.77 144.65,64.77 148.46,60.96 161.16,60.96 v164.97,59.69 | E2.13 261.49,88.9 261.49,92.71 260.22,93.98 250.06,93.98 247.52,96.52 243.71,96.52 241.17,93.98 v231.01,93.98 220.85,93.98 219.58,95.25 206.88,95.25 204.34,92.71 195.45,92.71 194.18,91.44 v191.64,91.44 182.75,91.44 181.48,92.71 168.78,92.71 v167.51,93.98 | E14.4 186.56,118.11 186.56,124.46 187.83,125.73 200.53,125.73 201.8,124.46 v206.88,124.46
!INTERNAL_IO  (via drill 0.81)
  Top 0.813: OMNIBUS.CL1 98.93,8.89 98.93,19.05 v97.66,22.86 | v172.59,22.86 167.51,31.75 167.51,43.18 164.97,45.72 164.97,48.26 166.24,49.53 166.24,58.42 167.51,59.69 166.24,60.96 166.24,77.47 E17.4
  Bottom 0.813: E17.4 171.32,81.28 172.59,82.55 172.59,87.63 171.32,88.9 E17.1 | v97.66,22.86 98.93,22.86 105.28,25.4 106.55,27.94 123.06,27.94 128.14,24.13 154.81,24.13 156.08,25.4 162.43,25.4 167.51,20.32 170.05,20.32 v172.59,22.86
!INTERRUPT  (via drill 0.81)
  Top 0.813: v92.58,138.43 88.77,133.35 88.77,127 86.23,124.46 86.23,106.68 84.96,105.41 84.96,92.71 83.69,91.44 83.69,83.82 83.06,82.55 83.06,59.69 83.69,58.42 83.69,40.64 82.42,39.37 v82.42,22.86 | OMNIBUS.CP1 90.04,8.89 90.04,16.51 v87.5,22.86 | E18.10 180.21,114.3 180.21,116.84 E18.13
  Bottom 0.813: v92.58,138.43 93.85,137.16 136.4,137.16 137.67,135.89 140.21,135.89 150.37,128.27 161.16,128.27 164.97,124.46 171.32,124.46 172.59,123.19 172.59,121.92 176.4,119.38 E18.13 | v82.42,22.86 v87.5,22.86
!IOT
  Top 0.813: E30.11 E30.10
  Bottom 0.813: E30.5 E30.10 | E30.11 92.58,52.07 92.58,55.88 94.49,57.78 97.03,57.78 97.66,57.15 105.28,57.15 107.19,59.05 118.62,59.05 128.14,50.8 E24.3
!MD3  (via drill 0.81)
  Top 0.813: OMNIBUS.AP1 223.39,8.89 v223.39,21.59 | v148.46,30.48 E24.9
  Bottom 0.813: v223.39,21.59 210.69,21.59 203.07,29.21 197.99,29.21 194.18,33.02 194.18,35.56 192.91,36.83 186.56,36.83 181.48,33.02 175.13,33.02 172.59,30.48 167.51,30.48 166.24,31.75 161.16,31.75 159.89,30.48 v148.46,30.48
!MD4
  Top 0.813: E20.12 161.16,46.99 161.16,25.4 166.24,20.32 166.24,8.89 OMNIBUS.BK1
!MD5
  Top 0.813: OMNIBUS.BL1 162.43,8.89 162.43,21.59 159.89,24.13 159.89,40.64 E20.9
!MD6
  Top 0.813: OMNIBUS.BM1 159.89,8.89 159.89,21.59 156.08,25.4 156.08,33.02 E20.7
!MD7  (via drill 0.81)
  Top 0.813: OMNIBUS.BP1 153.54,11.43 153.54,33.02 147.19,40.64 147.19,45.72 E20.4 144.65,53.34 v144.65,78.74
  Bottom 0.813: E25.10 v144.65,78.74
!MD8  (via drill 0.81)
  Top 0.813: OMNIBUS.DK1 32.89,8.89 32.89,22.86 v36.7,26.67 | v163.7,27.94 163.7,41.91 162.43,43.18 162.43,48.26 161.16,49.53 161.16,71.12 162.43,72.39 162.43,76.2 E21.11 | E24.7 131.95,38.1 v131.95,26.67
  Bottom 0.813: v36.7,26.67 39.24,29.21 77.34,29.21 78.61,27.94 96.39,27.94 98.93,30.48 125.6,30.48 v131.95,26.67 152.27,26.67 153.54,27.94 v163.7,27.94
!MD9  (via drill 0.81)
  Top 0.813: OMNIBUS.DL1 29.08,8.89 29.08,22.86 v32.89,26.67 | v96.39,30.48 100.2,35.56 100.2,46.99 E30.12
  Bottom 0.813: v32.89,26.67 36.7,30.48 79.88,30.48 81.15,29.21 95.12,29.21 v96.39,30.48
!MD10  (via drill 0.81)
  Top 0.813: OMNIBUS.DM1 26.54,10.16 26.54,24.13 v29.08,26.67 | v93.85,30.48 98.93,38.1 98.93,40.64 E30.9
  Bottom 0.813: v29.08,26.67 34.16,31.75 81.15,31.75 82.42,30.48 v93.85,30.48
!MD11  (via drill 0.81)
  Top 0.813: OMNIBUS.DP1 20.19,8.89 v20.19,26.67 | E30.4 86.23,45.72 86.23,38.1 v83.69,31.75
  Bottom 0.813: v83.69,31.75 81.15,34.29 27.81,34.29 v20.19,26.67
!MOTOR_STOPPING  (via drill 0.81)
  Top 0.813: OMNIBUS.BA1 191.64,8.89 191.64,19.05 195.45,22.86 v195.45,25.4 | E12.3 186.56,46.99 186.56,34.29 v187.83,33.02 | v241.17,52.07 241.17,55.24 239.27,57.15 237.36,57.15 234.82,59.69 234.82,93.34 233.55,94.61 233.55,121.92 232.28,123.19 232.28,124.46 | 232.28,124.46 232.28,125.73 233.55,127 v233.55,135.89 | v208.15,129.54 210.69,132.08 210.69,135.89 208.15,138.43 208.15,142.24 E11.5 | v228.47,124.46 232.28,124.46
  Bottom 0.813: v187.83,33.02 v195.45,25.4 | E12.3 192.91,53.34 192.91,57.15 195.45,59.69 219.58,59.69 221.49,57.78 221.49,53.98 223.39,52.07 v241.17,52.07 | E4.6 248.79,142.24 242.44,134.62 234.82,134.62 v233.55,135.89 | v208.15,129.54 210.69,127 213.23,127 214.5,125.73 219.58,125.73 222.12,123.19 227.2,123.19 v228.47,124.46
!MULTI_OUT  (via drill 0.81)
  Top 0.813: R34.1 R35.1 227.2,58.42 227.2,63.5 224.66,67.31 224.66,77.47 227.2,80.01 v227.2,97.79 | v238.63,168.91 v234.82,168.91 | v142.11,189.23 Q6.1 129.41,190.5 121.79,190.5 117.35,186.06 113.54,186.06 R44.2 | v157.35,187.96 161.16,184.15 161.16,179.07 164.97,176.53 v164.97,170.18
  Bottom 0.813: R44.2 104.65,175.9 D6.C | v227.2,97.79 229.74,95.25 239.9,95.25 242.44,97.79 248.79,97.79 251.33,95.25 252.6,95.25 255.14,97.79 255.14,110.49 E3.11 261.49,116.84 261.49,156.21 260.22,157.48 256.41,157.48 253.87,160.02 253.87,165.1 251.97,167 240.54,167 v238.63,168.91 | v234.82,168.91 229.11,168.91 225.3,172.72 221.49,172.72 219.58,171.45 218.31,171.45 213.23,176.53 192.28,176.53 187.83,171.45 178.94,171.45 176.4,173.99 171.96,173.99 169.42,170.81 166.24,170.81 v164.97,170.18 | v142.11,189.23 143.38,189.87 154.81,189.87 v157.35,187.96
!PAUSE  (via drill 0.81)
  Top 0.813: OMNIBUS.CD1 117.98,8.89 117.98,15.24 121.79,19.05 124.33,19.05 126.87,21.59 126.87,35.56 v125.6,36.83 | E16.7 v170.05,34.29
  Bottom 0.813: v125.6,36.83 126.87,35.56 135.76,35.56 137.03,34.29 149.73,34.29 151,33.02 157.35,33.02 158.62,34.29 v170.05,34.29
!PCE  (via drill 0.81)
  Top 0.813: v121.79,49.53 121.79,76.2 120.52,77.47 120.52,85.09 119.25,86.36 119.25,96.52 116.71,99.06 116.71,104.14 119.25,106.68 E29.9
  Bottom 0.813: E27.13 v121.79,49.53
!PCF
  Top 0.813: E27.11 119.25,45.72 119.25,73.66 E28.9
!PPC
  Top 0.813: E27.9 120.52,41.91 120.52,74.93 119.25,76.2 119.25,83.82 E28.13
!PSF  (via drill 0.81)
  Top 0.813: v121.79,46.99 123.06,48.26 123.06,77.47 121.79,78.74 121.79,86.36 120.52,87.63 120.52,97.79 119.25,99.06 119.25,104.14 120.52,105.41 120.52,107.95 119.25,109.22 119.25,111.76 E29.11
  Bottom 0.813: E27.12 v121.79,46.99
!PUNCH_DONE  (via drill 0.81)
  Top 0.813: E26.13 138.94,121.28 138.94,122.56 138.3,123.19 138.3,160.02 141.48,166.37 141.48,176.53 v144.65,180.34 | E15.6 187.83,144.78 187.83,157.48 178.94,166.37 178.94,180.34 v180.21,182.88 | E10.3 208.15,119.38 208.15,120.65 205.61,123.19 v205.61,146.05
  Bottom 0.813: E14.10 204.34,111.76 E10.3 | E15.6 194.18,146.05 194.18,154.94 197.36,156.84 198.63,156.84 v205.61,146.05 | v144.65,180.34 148.46,177.8 161.8,177.8 164.34,180.34 175.13,180.34 177.67,182.88 v180.21,182.88
!PUNCH_FEED  (via drill 0.81)
  Top 0.813: v18.92,88.9 v17.65,93.98 | v50.67,194.31 49.4,193.04 49.4,143.51 v45.59,139.7 43.05,134.62 43.05,111.76 40.51,109.22 40.51,99.06 R7.1 E37.1 | E13.1 C64.1 186.56,95.25 186.56,100.33 184.02,102.87 184.02,105.41 185.29,106.68 185.29,127 182.75,129.54 182.75,135.89 v184.02,138.43
  Bottom 0.813: J1.D v50.67,194.31 | E43.1 15.11,93.98 v17.65,93.98 | R7.1 32.89,95.25 25.27,93.98 v18.92,88.9 | v45.59,139.7 46.86,140.97 73.53,140.97 76.07,138.43 78.61,138.43 81.15,140.97 137.03,140.97 139.57,138.43 141.48,138.43 147.19,133.99 159.89,133.99 161.16,133.35 176.4,133.35 v184.02,138.43
!PUNCH_STROBE  (via drill 0.81)
  Top 0.813: v40.51,76.2 37.97,83.82 41.78,87.63 v41.78,92.71 | v62.1,123.19 v62.1,137.16 | v162.43,101.6 162.43,109.22 E22.11 161.16,118.11 v161.16,124.46
  Bottom 0.813: E43.6 4.95,73.66 4.95,69.85 7.49,67.31 36.7,67.31 v40.51,76.2 E37.6 | v162.43,101.6 168.15,101.6 170.69,99.06 177.67,99.06 182.75,101.6 186.56,101.6 187.83,102.87 201.8,102.87 208.15,109.22 208.15,111.76 E10.4 | v41.78,92.71 45.59,96.52 45.59,97.79 51.94,104.14 63.37,104.14 64.64,105.41 64.64,120.65 v62.1,123.19 | v62.1,137.16 64.64,134.62 78.61,134.62 81.15,132.08 83.69,132.08 86.23,134.62 135.13,134.62 141.48,128.27 147.19,128.27 148.46,127 157.35,127 v161.16,124.46
!R_FEED_SW  (via drill 0.81)
  Top 0.813: v234.82,160.02 v234.82,124.46 235.46,123.83 235.46,97.16 236.09,96.52 236.09,88.9 E5.13
  Bottom 0.813: J2.TT 88.77,151.13 90.04,149.86 95.12,149.86 96.39,151.13 96.39,152.4 98.93,154.94 107.82,154.94 110.36,152.4 125.6,152.4 129.41,156.21 141.48,156.21 144.65,159.38 207.52,159.38 C63.1 210.69,160.02 213.23,157.48 215.77,157.48 217.04,158.75 223.39,158.75 R49.1 227.2,157.48 228.47,158.75 233.55,158.75 v234.82,160.02 | E6.1 v234.82,124.46
!R_OFFLINE
  Top 0.813: E23.10 161.16,148.59 161.16,156.21 159.89,157.48 159.89,163.83 | 159.89,163.83 159.89,171.45 R6.2 | 159.89,163.83 164.97,163.83 167.51,166.37 167.51,171.45 166.24,172.72 166.24,177.8 162.43,180.34 C51.1
  Bottom 0.813: J2.F 83.69,191.77 86.23,189.23 92.58,189.23 93.22,188.59 116.08,188.59 117.98,190.5 135.76,190.5 137.03,191.13 158.62,191.13 162.43,187.96 C51.1
!RBC
  Bottom 0.813: E28.4 110.36,81.28 111.63,82.55 111.63,87.63 110.36,88.9 E28.1 101.47,88.9 98.93,91.44 93.85,91.44 92.58,90.17 92.58,85.09 E31.4
!RDR_RUN  (via drill 0.81)
  Top 0.813: v246.25,86.36 246.25,90.17 243.71,92.71 243.71,109.22 240.54,112.39 v240.54,136.53
  Bottom 0.813: E2.6 246.25,80.01 v246.25,86.36 | v240.54,136.53 236.73,136.53 235.46,137.79 230.38,137.79 228.47,139.7 228.47,143.51 222.12,146.05 222.12,148.59 E11.13
!RFC
  Bottom 0.813: E31.9 100.2,74.93 105.28,74.93 E28.5
!RIOP2  (via drill 0.81)
  Top 0.813: v143.38,59.69 142.11,60.96 142.11,81.28 140.84,82.55 140.84,89.53 139.57,90.81 139.57,110.49 v140.84,111.76
  Bottom 0.813: E1.1 244.98,55.88 243.71,57.15 224.03,57.15 220.22,60.96 194.18,60.96 191.64,58.42 170.05,58.42 167.51,55.88 159.89,55.88 157.35,58.42 144.65,58.42 v143.38,59.69 | E22.3 143.38,115.57 v140.84,111.76
!RIOP4  (via drill 0.81)
  Top 0.813: v225.93,60.96 223.39,66.04 223.39,83.82 224.66,85.09 224.66,90.17 219.58,95.25 219.58,105.41 222.12,107.95 222.12,133.35 223.39,134.62 223.39,135.89 222.12,137.16 220.85,137.16 E11.8 | E1.2 248.79,55.88 251.33,58.42 251.33,62.23 250.06,63.5 250.06,69.85 248.79,71.12 248.79,78.74 E2.4
  Bottom 0.813: E1.2 253.87,55.88 248.79,60.96 246.25,60.96 244.98,59.69 227.2,59.69 v225.93,60.96
!RPE  (via drill 0.81)
  Top 0.813: E29.3 106.55,115.57 96.39,99.06 96.39,93.98 102.74,87.63 v102.74,81.28
  Bottom 0.813: E31.13 v102.74,81.28
!RRB
  Bottom 0.813: E31.11 104.01,76.2 106.55,78.74 106.55,83.82 E28.2
!RSF  (via drill 0.81)
  Top 0.813: E29.1 106.55,120.65 95.12,100.33 95.12,92.71 101.47,86.36 101.47,80.01 v102.74,78.74
  Bottom 0.813: E31.12 v102.74,78.74
!SHIFT_PULSE  (via drill 0.81)
  Top 0.813: E1.6 248.79,40.64 251.33,38.1 252.6,38.1 255.14,40.64 255.14,63.5 257.68,66.04 255.14,68.58 255.14,100.33 v251.33,104.14
  Bottom 0.813: E12.4 192.91,45.72 192.91,41.91 196.72,38.1 214.5,38.1 215.77,36.83 238.63,36.83 239.9,38.1 252.6,38.1 253.87,39.37 253.87,40.64 E1.6 | v251.33,104.14 250.06,102.87 227.2,102.87 223.39,106.68 223.39,111.76 224.66,113.03 229.74,113.03 E6.5
!SKIP  (via drill 0.81)
  Top 0.813: OMNIBUS.CS1 83.69,8.89 83.69,16.51 78.61,22.86 78.61,39.37 82.42,41.91 82.42,57.15 81.79,58.42 81.79,83.82 82.42,85.09 v82.42,92.71 | E18.1 168.78,121.92 167.51,120.65 167.51,115.57 168.78,114.3 | E18.4 168.78,114.3 | 168.78,114.3 167.51,113.03 v167.51,96.52
  Bottom 0.813: v82.42,92.71 84.96,95.25 105.28,95.25 107.82,99.69 117.35,99.69 117.98,99.06 126.87,99.06 127.51,99.69 157.99,99.69 159.89,97.79 166.24,97.79 v167.51,96.52
+3V3
  Top 0.813: D1.A R33.1 | Q1.1 185.29,196.85 186.56,195.58 R22.2 | C65.+ 193.55,187.96 C57.+
  Bottom 0.813: R33.1 Q5.1 155.45,194.94 149.1,194.94 Q4.1 | Q1.1 180.21,199.39 168.78,199.39 D1.A | C65.+ R22.2
+3VR40  (via drill 0.81)
  Top 0.813: E12.1 R40.1 | v204.34,119.38 205.61,118.11 205.61,77.47 203.07,74.93 v203.07,64.77
  Bottom 0.813: R40.1 185.29,63.5 186.56,62.23 190.37,62.23 192.91,64.77 194.18,64.77 196.72,67.31 199.26,64.77 v203.07,64.77 | E14.13 v204.34,119.38
-15V  (via drill 0.81)
  Top 0.813: C66.- 200.53,194.31 Q2.3 218.31,196.85 218.31,201.93 215.77,204.47 162.43,204.47 v159.89,201.93 | Q6.3 125.6,201.93 120.52,201.93 112.9,194.31 R32.1
  Bottom 0.813: R32.1 109.73,189.87 103.38,189.87 R24.1 | Q2.3 220.85,198.12 R27.1 252.6,198.12 264.03,186.69 264.03,27.94 257.68,21.59 257.68,8.89 OMNIBUS.AB2 | Q6.3 130.68,199.39 133.22,201.93 145.92,201.93 148.46,200.66 152.27,200.66 154.81,201.93 v159.89,201.93
A+B  (via drill 0.81)
  Top 0.813: v205.61,74.93 206.88,76.2 206.88,119.38 204.34,121.92 204.34,133.35 203.07,134.62 203.07,146.69 205.61,149.22 v205.61,154.94 E11.2 | E32.4 91.31,116.84 91.31,129.54 95.12,132.08 101.47,140.97 104.01,149.86 v106.55,152.4
  Bottom 0.813: E13.8 199.26,74.93 v205.61,74.93 | v106.55,152.4 110.36,149.86 125.6,149.86 130.68,154.94 142.11,154.94 145.29,158.12 200.53,158.12 v205.61,154.94
BA
  Bottom 0.813: J2.JJ 120.52,161.29 121.79,162.56 137.03,162.56 140.21,165.74 202.44,165.74 203.71,167 214.5,167 223.39,171.45 224.66,171.45 229.11,167 235.46,167 236.73,168.28 236.73,170.81 239.9,172.72 251.33,172.72 255.78,168.28 255.78,160.66 257.68,158.75 261.49,158.75 262.76,157.48 262.76,109.22 E3.8
BB  (via drill 0.81)
  Top 0.813: v246.25,162.56 246.25,124.46 247.52,123.19 247.52,113.03 E3.6
  Bottom 0.813: J2.NN 88.77,156.21 90.04,154.94 96.39,154.94 98.93,157.48 124.33,157.48 125.6,158.75 140.21,158.75 143.38,161.93 204.34,161.93 205.61,163.19 245.62,163.19 v246.25,162.56
BTP3  (via drill 0.81)
  Top 0.813: v163.7,95.25 163.7,127 164.97,128.27 v164.97,130.81 159.89,127 159.89,119.38 E22.12 | E11.9 222.12,138.43 223.39,138.43 224.66,137.16 224.66,133.35 v223.39,132.08
  Bottom 0.813: E22.2 E22.12 158.62,116.84 159.89,115.57 159.89,113.03 158.62,111.76 E22.10 E22.4 144.65,111.76 144.65,110.49 E26.8 | E13.4 181.48,86.36 181.48,90.17 180.21,91.44 167.51,91.44 v163.7,95.25 | v164.97,130.81 168.78,128.27 177.67,128.27 184.02,134.62 201.17,134.62 202.44,135.89 213.23,135.89 215.14,133.99 220.22,133.99 222.12,132.08 v223.39,132.08
CLOCK_PULSE  (via drill 0.81)
  Top 0.813: v256.41,30.48 264.03,38.1 264.03,53.34 258.95,58.42 258.95,60.96 261.49,63.5 261.49,67.31 v258.95,69.85 | v87.5,102.87 86.23,101.6 86.23,91.44 84.96,90.17 84.96,82.55 84.33,81.28 84.33,60.96 84.96,59.69 84.96,53.34 v86.23,52.07 | v214.5,31.75 214.5,41.91 E8.10
  Bottom 0.813: E32.9 v87.5,102.87 | E5.10 247.52,68.58 257.68,68.58 v258.95,69.85 261.49,72.39 261.49,78.74 E2.11 | v256.41,30.48 252.6,30.48 248.79,34.29 243.71,34.29 242.44,33.02 215.77,33.02 v214.5,31.75 210.69,27.94 206.88,27.94 203.07,31.75 197.99,31.75 195.45,34.29 195.45,36.83 194.18,38.1 185.29,38.1 180.21,34.29 173.86,34.29 171.32,31.75 168.78,31.75 167.51,33.02 159.89,33.02 158.62,31.75 149.73,31.75 148.46,33.02 135.76,33.02 134.49,34.29 101.47,34.29 100.2,35.56 88.77,35.56 84.96,39.37 84.96,49.53 v86.23,52.07
COIL_BIAS  (via drill 0.81)
  Top 0.813: v98.93,146.05 90.04,149.86 90.04,158.75 v91.31,162.56
  Bottom 0.813: J1.BB 58.29,168.91 65.91,158.75 65.91,149.86 69.72,146.05 v98.93,146.05 | R10.1 228.47,175.26 224.66,180.34 217.04,180.34 215.77,179.07 164.97,179.07 162.43,176.53 144.65,176.53 142.11,179.07 112.9,179.07 109.09,175.26 109.09,172.72 111.63,170.18 111.63,167.64 106.55,162.56 v91.31,162.56
ENABLE  (via drill 0.81)
  Top 0.813: E4.2 E4.1 | E5.11 241.17,78.74 241.17,73.66 237.36,69.85 237.36,60.96 238.63,59.69 240.54,59.69 244.98,55.24 244.98,50.8 243.71,49.53 243.71,48.26 244.98,46.99 247.52,46.99 E1.3 | v260.22,59.69 264.03,63.5 264.03,132.08 v258.95,137.16 | E26.3 124.33,120.65 124.33,133.35 125.6,137.16 125.6,160.02 119.89,162.56 119.89,185.42 122.43,187.96 130.68,187.96 131.95,186.69 140.84,186.69 v143.38,184.15 | E7.2 E7.1 228.47,157.48 228.47,161.29 224.66,163.83 222.12,163.83 220.85,165.1 220.85,168.91 222.12,170.18 222.12,177.8 220.85,179.07 v220.85,182.88
  Bottom 0.813: E1.3 255.14,54.61 255.14,57.15 v260.22,59.69 | E7.1 236.09,154.94 238.63,157.48 241.17,154.94 E4.1 | E4.2 255.14,148.59 255.14,139.7 v258.95,137.16 | v143.38,184.15 145.29,186.06 147.19,186.06 153.54,179.71 161.16,179.71 166.88,186.06 173.23,186.06 R20.1 183.39,186.06 193.55,186.06 194.18,185.42 199.26,185.42 204.34,180.34 208.15,180.34 210.69,182.88 213.23,182.88 215.77,185.42 218.31,182.88 v220.85,182.88
FEED_HOLE
  Bottom 0.813: J2.DD 100.2,166.37 102.74,163.83 104.01,163.83 105.28,165.1 105.28,171.45 107.82,173.99 107.82,176.53 R1.1
GND  (via drill 0.81)  (1 unrouted)
  Top 0.813: R5.1 145.92,171.45 148.46,168.91 C23.2 149.73,157.48 152.27,154.94 152.27,142.24 E23.7 C22.2 152.27,109.22 E22.7 C21.2 E21.1 152.27,86.36 152.27,67.31 C20.2 E20.1 | E13.7 194.18,77.47 C64.2 C13.2 E14.7 192.91,109.22 192.91,119.38 195.45,121.92 191.64,125.73 C14.2 191.64,138.43 E15.7 192.91,142.24 192.91,149.86 E15.2 E15.1 190.37,158.75 C15.2 | E2.7 251.33,71.12 252.6,69.85 C2.2 253.87,62.23 253.87,43.18 E1.7 | E9.7 C8.2 210.69,60.96 213.23,58.42 213.23,43.18 E8.7 210.69,24.13 | E13.7 C12.2 192.91,60.96 192.91,53.34 | C33.2 E34.8 65.91,73.66 65.91,78.74 E34.4 72.26,85.09 72.26,93.98 C34.2 E35.7 70.99,109.22 70.99,128.27 C35.2 | 91.31,71.12 91.31,67.31 C30.2 E30.1 91.31,53.34 91.31,45.72 E30.6 91.31,40.64 91.31,36.83 90.04,35.56 90.04,27.94 | E31.8 91.31,71.12 | 91.31,71.12 91.31,100.33 E32.7 | C32.2 R27.3 | OMNIBUS.DT2 10.03,8.89 v10.03,25.4 10.03,53.34 | OMNIBUS.DN2 22.73,8.89 v22.73,22.86 | OMNIBUS.DF2 41.78,8.89 41.78,17.78 45.59,21.59 45.59,22.86 | OMNIBUS.DC1 51.94,8.89 v51.94,22.86 45.59,22.86 | OMNIBUS.CT2 79.88,8.89 v79.88,19.05 76.07,22.86 E33.7 | OMNIBUS.CN1 92.58,8.89 v92.58,22.86 90.04,27.94 | OMNIBUS.CF1 111.63,8.89 111.63,15.24 v117.98,21.59 | OMNIBUS.CC1 121.79,8.89 121.79,15.24 124.33,17.78 125.6,17.78 128.14,20.32 128.14,25.4 | 128.14,25.4 128.14,38.1 C47.- | 128.14,25.4 133.22,25.4 133.22,30.48 | 133.22,30.48 133.22,39.37 131.95,40.64 131.95,53.34 E24.1 C24.2 131.95,67.31 131.95,86.36 E25.1 C25.2 E26.7 131.95,109.22 131.95,128.27 C26.2 | OMNIBUS.BT2 143.38,8.89 v143.38,21.59 140.84,24.13 140.84,30.48 133.22,30.48 | OMNIBUS.BN2 156.08,8.89 v156.08,21.59
  Top 0.813: D7.A D4.A | C48.- 121.79,172.72 v126.87,167.64 | OMNIBUS.BF2 175.13,8.89 175.13,19.05 | 175.13,19.05 C16.2 172.59,26.67 172.59,43.18 | C45.- C61.2 246.25,29.21 v241.17,22.86 | OMNIBUS.AT2 213.23,8.89 213.23,21.59 | 213.23,21.59 215.77,24.13 223.39,24.13 225.93,21.59 225.93,19.05 | OMNIBUS.AN2 225.93,8.89 225.93,19.05 | v241.17,22.86 237.36,19.05 225.93,19.05 | OMNIBUS.AF2 244.98,8.89 244.98,19.05 v241.17,22.86 | 10.03,53.34 E42.1 C42.2 E43.8 10.03,73.66 10.03,81.28 | E41.7 30.35,106.68 | 30.35,106.68 30.35,99.06 C40.2 31.62,93.98 31.62,85.09 E40.4 | C41.2 30.35,128.27 30.35,106.68 | OMNIBUS.BC1 185.29,8.89 185.29,19.05 | 185.29,19.05 175.13,19.05 | 185.29,19.05 187.83,21.59 187.83,27.94 189.1,29.21 205.61,29.21 210.69,24.13 | 210.69,24.13 213.23,21.59 | C63.2 C11.2 R36.1 208.15,177.8 208.15,180.34 210.69,182.88 210.69,187.96 228.47,199.39 R12.1 | E19.7 C19.2 v173.86,125.73 173.86,110.49 E18.7 C18.2 172.59,92.71 172.59,76.2 E17.7 C17.2 E16.1 172.59,53.34 172.59,43.18 | v22.73,22.86 22.73,35.56 E39.7 31.62,44.45 31.62,57.15 C39.2 | 45.59,22.86 45.59,35.56 50.67,40.64 50.67,53.34 E36.1 C36.2 E37.8 45.59,73.66 45.59,78.74 E37.4 | v111.63,127 116.71,132.08 v120.52,132.08 | E29.7 C29.2 109.09,91.44 111.63,88.9 111.63,76.2 E28.7 C28.2 111.63,60.96 111.63,40.64 E27.8 109.09,26.67 C27.2 107.82,21.59 106.55,20.32 102.74,20.32 97.66,26.67 96.39,27.94 90.04,27.94 | v22.73,22.86 25.27,25.4 25.27,30.48 32.89,38.1 32.89,62.23 30.35,66.04 E40.8 | 10.03,81.28 10.03,95.25 C43.2 E44.7 10.03,109.22 10.03,127 C44.2 | C37.2 48.13,99.06 E38.7 50.67,109.22 50.67,128.27 C38.2 | 10.03,53.34 10.03,71.12 11.3,72.39 11.3,133.35 v7.49,137.16
  Top 0.813: E16.6 172.59,43.18 | C6.2 E7.7 233.55,142.24 233.55,157.48 232.28,160.02 C7.2 225.93,165.1 223.39,165.1 222.12,166.37 222.12,167.64 223.39,168.91 223.39,173.99 231.01,181.61 R13.1 | v187.83,187.96 190.37,186.06 193.55,186.06 195.45,184.15 C66.+ | C51.2 162.43,176.53 158.62,179.07 R6.1 | R46.1 185.29,73.66 E13.7 | E12.7 192.91,43.18 192.91,53.34 | E12.2 192.91,53.34 | C9.2 E10.7 213.23,109.22 213.23,119.38 | 213.23,119.38 213.23,123.19 210.69,125.73 C10.2 211.96,130.81 211.96,138.43 E11.7 | E10.2 213.23,119.38 | E2.2 253.87,88.9 253.87,95.25 C3.2 248.79,100.33 248.79,104.14 E3.7 253.87,109.22 253.87,119.38 255.14,120.65 255.14,123.19 251.33,127 C4.2 E4.7 | E5.7 228.47,76.2 228.47,95.25 C5.2 E6.7 | E43.4 10.03,81.28
  Bottom 0.813: J2.C J2.A J2.B J2.D J2.C | J2.C J2.E J2.H | J1.SS J1.UU | J1.TT J1.VV | J1.SS J1.TT | J1.SS J1.PP | J1.RR J1.NN J1.MM | J1.RR J1.TT | J1.MM J1.PP | J1.PP J1.RR | J1.MM J1.KK J1.HH J1.EE J1.CC J1.AA J1.Y J1.W J1.U J1.S J1.P J1.M J1.K | J1.K J1.L | J1.K J1.H J1.E J1.C J1.A J1.B | J2.H J2.K J2.M J2.P J2.S J2.U J2.W J2.Y J2.AA J2.CC J2.EE J2.HH J2.KK J2.MM J2.PP J2.SS J2.UU J2.VV 100.2,148.59 102.74,146.05 102.74,144.78 101.47,143.51 97.66,143.51 96.39,144.78 32.89,144.78 J1.VV | J2.J J2.H | C48.- C31.- | E1.7 248.79,40.64 C45.- 241.17,39.37 C62.2 C60.2 | OMNIBUS.AC2 255.14,8.89 255.14,19.05 253.87,20.32 | C1.2 253.87,20.32 | R13.1 236.09,189.23 239.9,189.23 C32.2 | C55.2 79.88,106.68 77.34,104.14 72.26,104.14 E35.7 | J1.VV J1.UU | J1.UU 10.03,148.59 7.49,146.05 v7.49,137.16 | OMNIBUS.DT2 10.03,8.89 v10.03,25.4 v22.73,22.86 | OMNIBUS.DN2 22.73,8.89 v22.73,22.86 | OMNIBUS.DF2 41.78,8.89 41.78,22.86 | 41.78,22.86 v22.73,22.86 | OMNIBUS.DC1 51.94,8.89 v51.94,22.86 | v51.94,22.86 41.78,22.86 | v51.94,22.86 55.75,19.05 59.56,19.05 62.1,21.59 76.07,21.59 v79.88,19.05 | OMNIBUS.CT2 79.88,8.89 v79.88,19.05 | OMNIBUS.CN1 92.58,8.89 92.58,19.05 | 92.58,19.05 v79.88,19.05 | 92.58,19.05 v92.58,22.86 | OMNIBUS.CF1 111.63,8.89 111.63,17.78 | 111.63,17.78 107.82,21.59 C27.2 | OMNIBUS.CC1 121.79,8.89 121.79,17.78 v117.98,21.59 114.17,17.78 111.63,17.78 | OMNIBUS.BT2 143.38,8.89 v143.38,21.59 v156.08,21.59 | OMNIBUS.BN2 156.08,8.89 v156.08,21.59 | D4.A 95.76,186.06 143.38,186.06 144.65,187.32 147.83,187.32 154.81,181.61 157.35,181.61 158.62,182.88 R6.1 162.43,184.15 166.24,187.96 C65.- D5.C 176.4,194.31 177.67,194.31 184.02,187.96 v187.83,187.96
  Bottom 0.813: v126.87,167.64 128.14,167 140.84,167 143.38,168.91 C23.2 | C46.- E12.7 | OMNIBUS.BC1 185.29,8.89 185.29,16.51 182.75,19.05 175.13,19.05 | 175.13,19.05 C16.2 | OMNIBUS.BF2 175.13,8.89 175.13,19.05 | OMNIBUS.AF2 244.98,8.89 244.98,19.05 | 244.98,19.05 252.6,19.05 253.87,20.32 | 244.98,19.05 v241.17,22.86 236.09,17.78 225.93,17.78 | 225.93,17.78 214.5,17.78 213.23,16.51 213.23,8.89 OMNIBUS.AT2 | OMNIBUS.AN2 225.93,8.89 225.93,17.78 | E43.13 18.92,81.28 26.54,71.12 E40.8 | E40.4 E40.13 E37.4 E37.13 | E34.8 70.99,71.12 73.53,81.28 E34.13 | 175.13,19.05 162.43,19.05 159.89,21.59 v156.08,21.59 | E24.11 133.22,48.26 131.95,49.53 131.95,53.34 E24.1 | E2.7 253.87,76.2 253.87,83.82 E2.2 | C36.2 51.94,60.96 65.91,60.96 C33.2 | C64.2 203.07,93.98 206.88,97.79 C9.2 | C5.2 233.55,100.33 248.79,100.33 C3.2 | v173.86,125.73 181.48,125.73 184.02,128.27 190.37,128.27 C14.2 | C26.2 v120.52,132.08 | C37.2 51.94,101.6 65.91,101.6 C34.2 | v111.63,127 112.9,125.73 112.9,110.49 E29.7 | C25.2 133.22,97.79 135.76,95.25 139.57,95.25 142.11,97.79 C21.2 | C51.2 162.43,167.64 168.78,167.64 172.59,171.45 176.4,171.45 178.94,168.91 C15.2 | R27.3 242.44,204.47 231.01,204.47 R12.1
  pour Top: 206.88,27.94 210.69,27.94 210.69,24.13 206.88,27.94
HAVE_TAPE  (via drill 0.81)
  Top 0.813: E26.10 142.75,116.2 142.75,132.72 144.65,134.62 144.65,144.78 142.11,147.32 142.11,156.21 144.02,159.38 144.02,174.62 145.92,176.53 v149.73,173.99 | E11.10 222.12,148.59 222.12,157.48 224.66,160.02 224.66,161.29 223.39,162.56 220.85,162.56 219.58,163.83 219.58,170.18 220.85,171.45 220.85,176.53 v219.58,177.8
  Bottom 0.813: v149.73,173.99 152.27,173.99 154.81,171.45 159.26,171.45 167.51,177.8 v219.58,177.8
INITIALIZE
  Top 0.813: OMNIBUS.CR1 86.23,10.16 86.23,19.05 84.96,20.32 84.96,25.4 87.5,27.94 87.5,36.83 E30.7
INT_ENA
  Bottom 0.813: E18.9 180.21,111.76 | 180.21,111.76 E14.5 | E18.11 180.21,111.76
IOT01  (via drill 0.81)
  Top 0.813: E17.5 E17.6 167.51,73.66 167.51,62.23 168.78,60.96 168.78,58.42 167.51,57.15 v167.51,46.99 | E21.3 144.65,83.82 143.38,85.09 v143.38,90.17 143.38,91.44 142.11,92.71 142.11,107.95 145.92,111.76 v145.92,125.73
  Bottom 0.813: E24.4 126.87,45.72 126.87,40.64 129.41,38.1 138.3,38.1 139.57,36.83 152.27,36.83 153.54,35.56 154.81,35.56 157.35,38.1 158.62,38.1 v167.51,46.99 | E17.5 167.51,81.28 159.89,93.98 147.19,93.98 v143.38,90.17 | E29.13 125.6,128.27 139.57,128.27 142.11,125.73 v145.92,125.73
IOT02  (via drill 0.81)
  Top 0.813: E17.3 E17.2 | E29.5 105.28,110.49 98.93,100.33 98.93,93.98 v102.74,91.44 | E24.5 126.87,48.26 126.87,53.34 125.6,54.61 125.6,76.2 126.87,77.47 126.87,81.28 E25.3
  Bottom 0.813: E17.2 167.51,87.63 161.16,95.25 147.19,95.25 146.56,95.25 145.92,95.25 140.84,92.71 135.76,92.71 133.22,95.25 123.06,95.25 120.52,92.71 | 120.52,92.71 120.52,91.44 | 120.52,91.44 120.52,90.17 | 120.52,90.17 123.06,87.63 125.6,87.63 E25.3 | v102.74,91.44 110.36,91.44 112.9,93.98 117.98,93.98 119.25,92.71 | 119.25,92.71 120.52,90.17 | 120.52,92.71 119.25,92.71 | 119.25,92.71 120.52,91.44
MOTOR_POWER  (via drill 0.81)
  Top 0.813: v93.85,152.4 97.66,156.21 97.66,173.99 87.5,181.61 87.5,189.23 86.23,190.5 86.23,205.74 88.77,208.28 119.25,208.28 120.52,207.01 131.32,207.01 132.59,205.74 152.27,205.74 157.35,200.66 157.35,199.39 149.73,191.77 149.73,176.53 151,175.26 151,171.45 153.54,168.91 153.54,135.89 154.81,134.62 154.81,123.19 153.54,121.92 v153.54,64.77 | E8.2 208.15,55.88 208.15,60.96 205.61,63.5 v205.61,68.58
  Bottom 0.813: J2.RR 88.77,153.67 90.04,152.4 v93.85,152.4 | v153.54,64.77 156.08,67.31 158.62,67.31 162.43,63.5 168.78,63.5 170.05,62.23 177.67,62.23 178.94,63.5 178.94,66.04 180.21,67.31 194.18,67.31 195.45,68.58 197.99,68.58 199.26,69.85 204.34,69.85 v205.61,68.58
N$1
  Top 0.813: E24.13 139.57,55.88 139.57,62.23 140.84,63.5 140.84,80.01 139.57,81.28 139.57,88.9 138.3,90.17 138.3,91.44 138.3,99.06 134.49,102.87 134.49,106.68 E26.9
N$2
  Bottom 0.813: R2.1 C48.+ C31.+ R1.2
N$3
  Top 0.813: Q8.1 139.57,179.07 Q7.1 143.38,181.61 R5.2
N$4  (via drill 0.81)
  Top 0.813: E30.13 98.93,55.88 98.93,63.5 100.2,64.77 v100.2,68.58
  Bottom 0.813: E31.1 86.23,86.36 86.23,69.85 87.5,68.58 v100.2,68.58 | E30.13 102.74,53.34 104.01,54.61 107.82,54.61 E27.1
N$5
  Top 0.813: E20.2 147.19,55.88 147.19,73.66 E21.6
  Bottom 0.813: E21.6 E25.9
N$6  (via drill 0.81)
  Top 0.813: E20.5 E20.6 | E20.11 E20.10 | E24.6 125.6,46.99 125.6,52.07 124.33,53.34 124.33,77.47 125.6,78.74 125.6,82.55 126.87,83.82 126.87,90.17 v125.6,91.44
  Bottom 0.813: E24.6 E24.10 E20.5 E20.10 | E20.11 E16.2 | v125.6,91.44 126.87,92.71 130.68,92.71 133.22,90.17 133.22,87.63 E25.12 134.49,81.28 134.49,73.66 137.03,71.12 139.57,73.66 147.19,73.66 149.73,71.12 152.27,73.66 152.27,78.74 E21.12
N$7
  Top 0.813: Q8.2 Q7.3 R3.1 129.41,186.69 126.87,186.69 124.33,184.15 124.33,172.72 128.14,168.91 128.14,162.56 133.22,157.48 133.22,139.7 126.87,132.08 126.87,124.46 E26.1
N$8
  Bottom 0.813: R2.2 126.87,181.61 128.14,180.34 131.95,180.34 135.76,184.15 Q7.2
N$9
  Bottom 0.813: Q8.3 131.95,168.91 129.41,171.45 R4.1
N$10
  Top 0.813: E24.14 137.03,62.23 139.57,64.77 139.57,78.74 E25.11
  Bottom 0.813: E25.11 E21.4
N$11
  Top 0.813: Q10.1 Q9.1
  Bottom 0.813: R8.1 Q10.1
N$12
  Top 0.813: E20.13 159.89,55.88 159.89,71.75 161.16,73.03 161.16,74.93 E21.10
  Bottom 0.813: E21.10 159.89,81.28 159.89,87.63 158.62,90.17 157.35,91.44 149.73,91.44 147.19,88.9 147.19,86.36 145.92,85.09 142.11,85.09 137.03,91.44 134.49,91.44 131.95,93.98 124.33,93.98 123.06,92.71 123.06,90.17 124.33,88.9 126.87,88.9 129.41,91.44 131.95,88.9 131.95,83.82 E25.4
N$13
  Top 0.813: Q9.2 215.77,186.69 217.04,187.96 224.66,187.96 | 224.66,187.96 C50.2 | 224.66,187.96 R11.2
N$14
  Top 0.813: E20.14 158.62,58.42 158.62,72.39 159.89,73.66 E21.9
  Bottom 0.813: E25.5 131.95,76.2 131.95,73.66 135.76,69.85 138.3,69.85 140.84,72.39 145.92,72.39 148.46,69.85 151,69.85 E21.9
N$15
  Top 0.813: E24.2 126.87,55.88 126.87,73.66 E25.6
N$16  (via drill 0.81)
  Top 0.813: v121.79,96.52 121.79,99.06 120.52,100.33 120.52,102.87 121.79,104.14 121.79,109.22 120.52,110.49 120.52,113.03 E29.12
  Bottom 0.813: E31.2 91.31,88.9 91.31,91.44 93.85,93.98 110.36,93.98 111.63,95.25 119.25,95.25 v121.79,96.52
N$17
  Top 0.813: E20.3 145.92,54.61 145.92,74.93 E21.5
N$18  (via drill 0.81)
  Top 0.813: E16.12 E16.11 | E29.6 106.55,109.22 100.2,99.06 100.2,96.52 105.28,91.44 105.28,76.2 v102.74,72.39 105.28,68.58 v105.28,52.07 | R28.1 v182.75,62.23
  Bottom 0.813: E27.2 v105.28,52.07 | E16.12 181.48,52.07 R28.1 | v102.74,72.39 105.28,69.85 130.68,69.85 133.22,67.31 137.03,67.31 138.3,66.04 145.92,66.04 149.73,62.23 167.51,62.23 168.78,60.96 181.48,60.96 v182.75,62.23
N$19
  Top 0.813: E30.14 96.39,63.5 98.93,66.04 98.93,81.28 E31.14
  Bottom 0.813: E30.14 106.55,55.88 108.46,57.78 117.98,57.78 119.25,55.88 119.25,53.34 E27.14
N$20  (via drill 0.81)
  Top 0.813: v101.47,40.64 101.47,48.26 100.2,49.53 100.2,62.23 102.74,64.77 102.74,68.58 100.2,71.12 100.2,82.55 E31.15
  Bottom 0.813: E30.3 86.23,48.26 86.23,40.64 88.77,38.1 97.66,38.1 v101.47,40.64 107.82,35.56 110.36,35.56 112.9,38.1 112.9,49.53 E27.15
N$21
  Top 0.813: Q10.2 215.77,179.07 218.31,181.61 Q9.3 225.93,185.42 228.47,187.96 R12.2 R9.1
N$22  (via drill 0.81)
  Top 0.813: v201.8,115.57 201.8,130.81 200.53,132.08 200.53,147.96 202.44,149.86 202.44,158.12 199.26,161.29 199.26,176.53 203.07,180.34 203.07,181.61 201.8,182.88 201.8,184.15 v206.88,187.96
  Bottom 0.813: Q10.3 225.93,173.99 228.47,171.45 229.74,171.45 231.01,172.72 R13.2 231.01,177.8 220.85,187.96 218.31,187.96 214.5,190.5 210.69,190.5 v206.88,187.96 | E14.11 v201.8,115.57
N$23  (via drill 0.81)
  Top 0.813: v173.86,66.04 173.86,100.33 v172.59,104.14 | v192.91,69.85 194.18,64.77 195.45,60.96 195.45,45.72 E12.9
  Bottom 0.813: E18.5 172.59,111.76 175.13,106.68 | 175.13,106.68 E18.8 | 175.13,106.68 v172.59,104.14 | v173.86,66.04 178.94,68.58 191.64,68.58 v192.91,69.85
N$24
  Top 0.813: E33.2 72.26,57.15 72.26,74.93 E34.5
N$25  (via drill 0.81)
  Top 0.813: v114.17,91.44 112.9,93.98 112.9,123.19 114.17,124.46 114.17,127 117.35,130.18 121.16,130.18 121.79,130.81 121.79,137.16 v112.9,154.94 | E11.11 220.85,149.86 220.85,158.75 v222.12,161.29
  Bottom 0.813: E28.6 112.9,80.01 112.9,90.17 v114.17,91.44 | v112.9,154.94 124.33,154.94 126.87,157.48 140.84,157.48 144.02,160.66 204.98,160.66 206.25,161.93 221.49,161.93 v222.12,161.29
N$26
  Top 0.813: E33.5 64.64,49.53 64.64,58.42 70.99,64.77 70.99,71.12 E34.7
N$27
  Top 0.813: E33.12 78.61,53.34 77.98,54.61 77.98,66.04 E34.9
N$28
  Top 0.813: E34.11 79.25,73.66 79.25,55.88 79.88,54.61 79.88,46.99 E33.9
N$29
  Top 0.813: E39.2 24,55.88 24,74.93 E40.5
N$30
  Top 0.813: E40.7 25.27,71.12 25.27,66.04 30.35,55.88 30.35,45.72 E39.6
N$31
  Top 0.813: E40.9 40.51,68.58 40.51,43.18 E39.8
N$32  (via drill 0.81)
  Top 0.813: v41.78,50.8 41.78,69.85 E40.11
  Bottom 0.813: E39.12 v41.78,50.8
N$33
  Top 0.813: E12.10 200.53,43.18 200.53,36.83 R42.1
N$34  (via drill 0.81)
  Top 0.813: v39.24,66.04 37.97,66.04 32.89,71.12 E40.10